# Altium project Inte_Car.PrjPCB
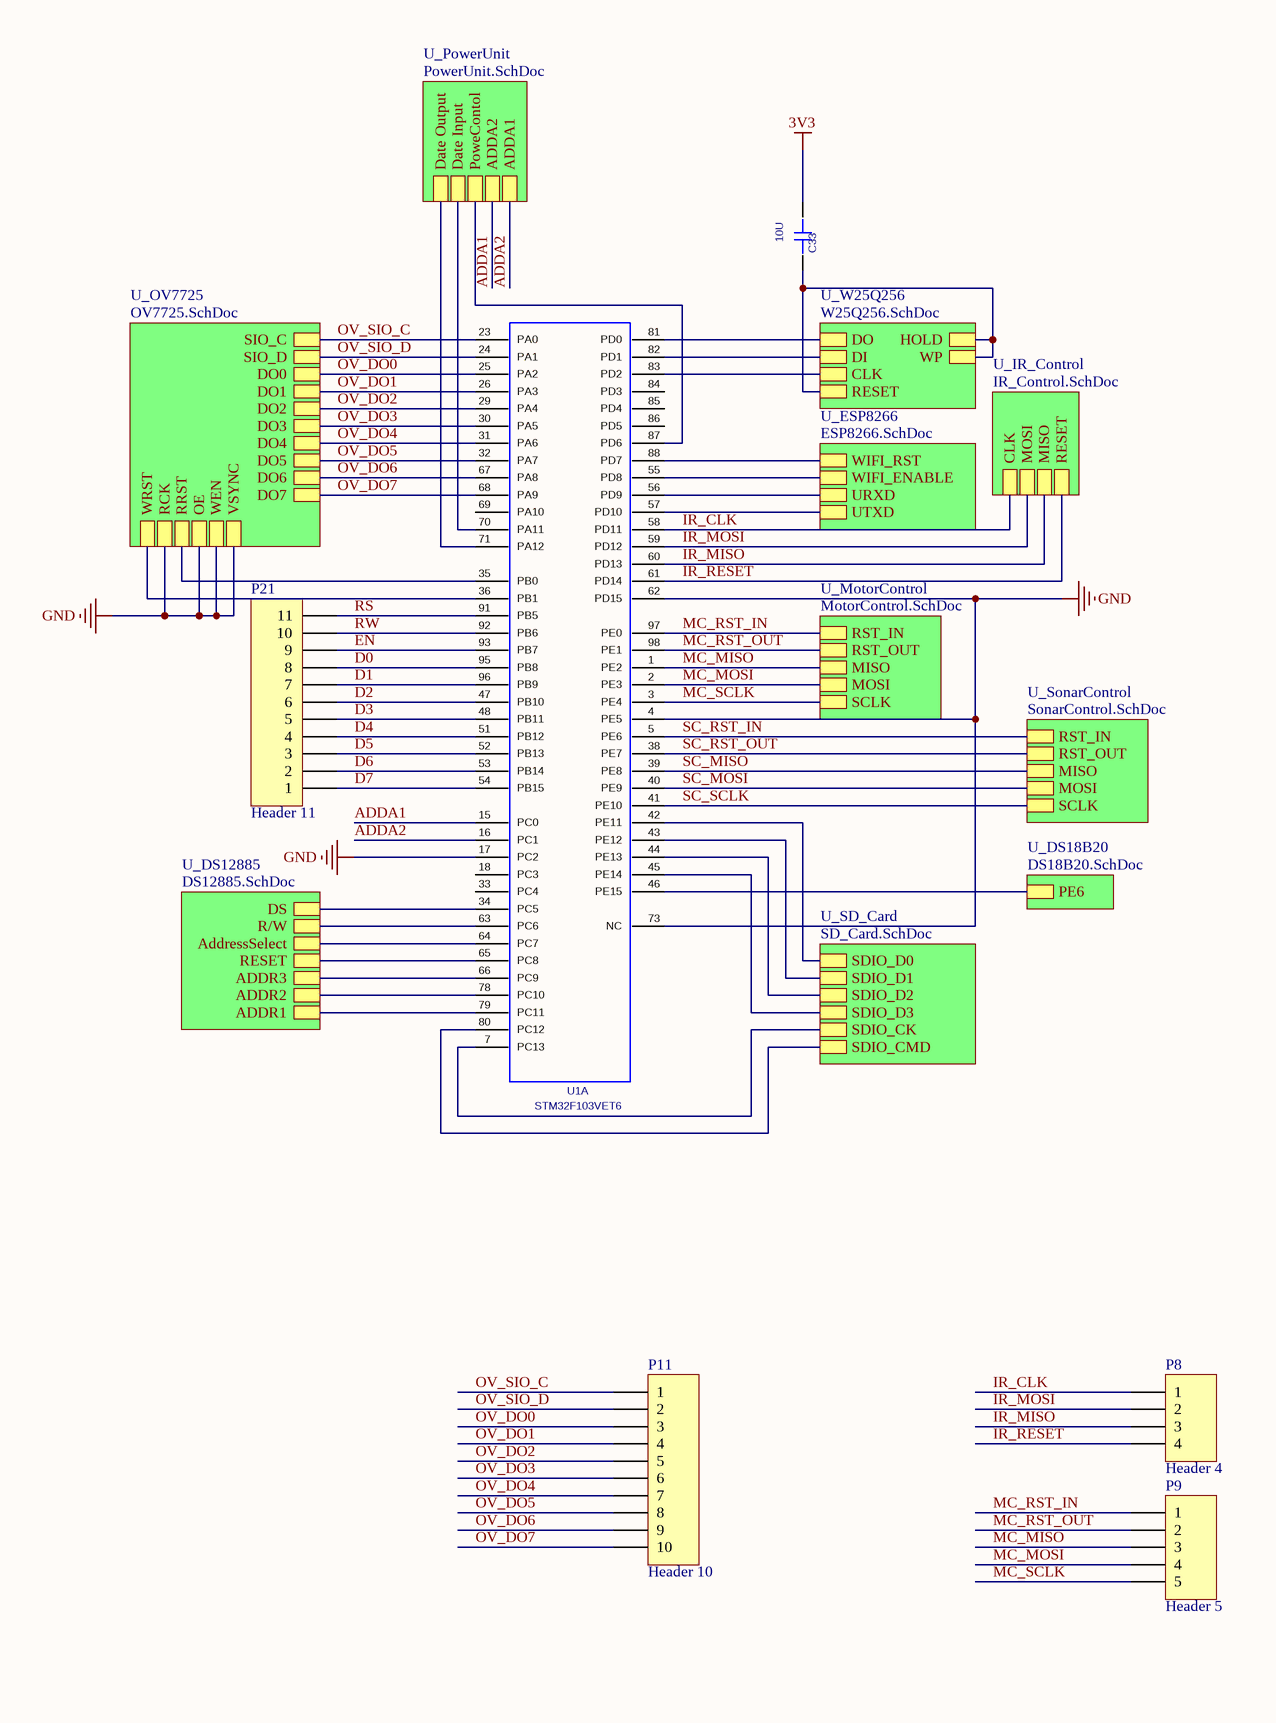
[diagram p0: MainBoard.SchDoc, left]
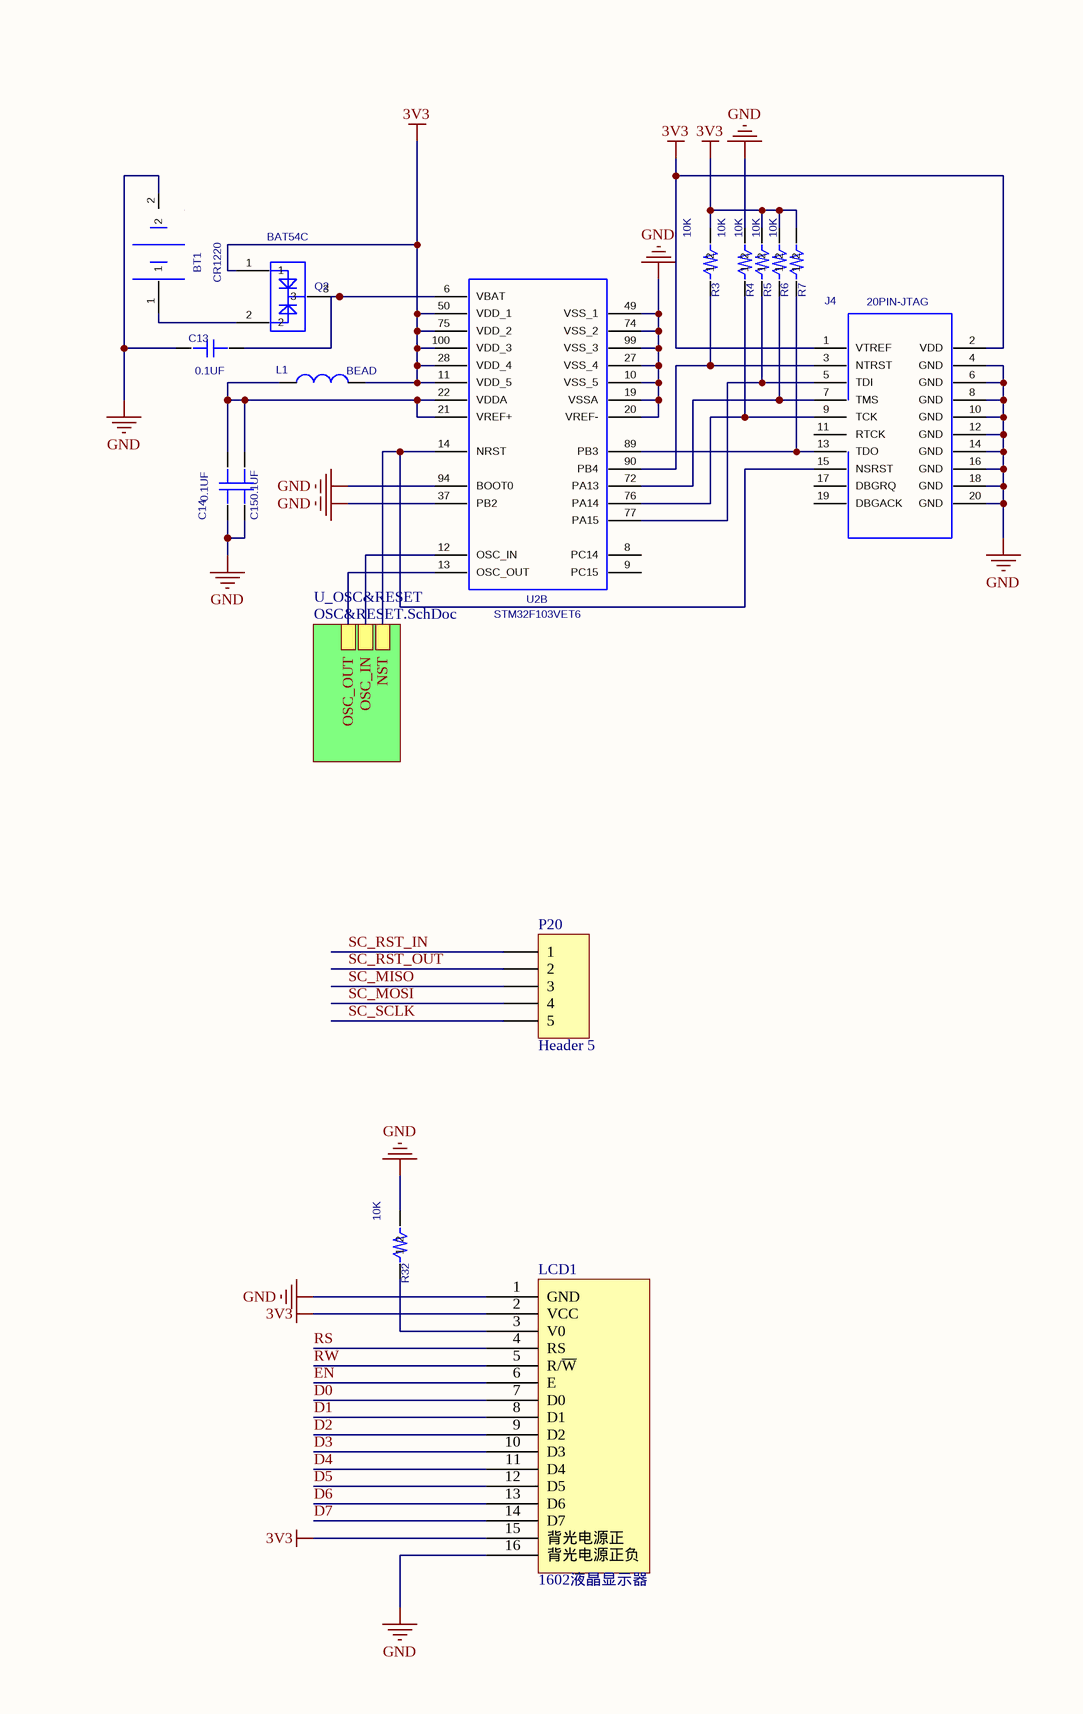
[diagram p1: MainBoard.SchDoc, right]
17 sheets, 196 parts. Net scope: hierarchical (ports join the sheet entries above them; power ports are global).
Board files: IR.PcbDoc, IR_Detector.PcbDoc, MotorControl.PcbDoc, SonarControl.PcbDoc, MainBoard.PcbDoc
Sheets:
  MainBoard.SchDoc
    U_OSC&RESET = OSC&RESET.SchDoc
    U_OV7725 = OV7725.SchDoc
      U_OV7725_CRYSTAL = OV7725_CRYSTAL.SchDoc
      U_AL422B = AL422B.SchDoc
      U_SN74LVC1G00 = SN74LVC1G00.SchDoc
    U_W25Q256 = W25Q256.SchDoc
    U_ESP8266 = ESP8266.SchDoc
      U_25Q80_SO = 25Q80_SO.SchDoc
    U_DS18B20 = DS18B20.SchDoc
    U_IR_Control = IR_Control.SchDoc
      U_IR = IR.SchDoc
      U_IR = IR.SchDoc
      U_IR = IR.SchDoc
      U_IR = IR.SchDoc
    U_MotorControl = MotorControl.SchDoc
    U_SonarControl = SonarControl.SchDoc
    U_SD_Card = SD_Card.SchDoc
    U_DS12885 = DS12885.SchDoc
    U_PowerUnit = PowerUnit.SchDoc

## Sheet MainBoard.SchDoc
size A3

### Parts
BT1  CR1220  [BATERY]
C13  value 0.1UF  [CAP_0603_FIRE]  (hidden comment: CAP_0.1UF_0603_FIRE)
C14  value 0.1UF  [CAP_0603_FIRE]  (hidden comment: CAP_0.1UF_0603_FIRE)
C15  value 0.1UF  [CAP_0603_FIRE]  (hidden comment: CAP_0.1UF_0603_FIRE)
C33  value 10U  [CAP_0603_FIRE]  (hidden comment: C_10UF_0603)
J4  20PIN-JTAG  [FC20H]
L1  value BEAD  [L0603]  (hidden comment: BEAD-220/100MHZ-0603)
LCD1  1602液晶显示器  [LCD1602A]
P8  Header 4  [HDR1X4]
P9  Header 5  [HDR1X5]
P11  Header 10  [HDR1X10]
P20  Header 5  [HDR1X5]
P21  Header 11  [HDR1X11]
Q2  BAT54C  [SOT-23]
R3  value 10K  [RES_0603_FIRE]  (hidden comment: RES_10K_0603_FIRE)
R4  value 10K  [RES_0603_FIRE]  (hidden comment: RES_10K_0603_FIRE)
R5  value 10K  [RES_0603_FIRE]  (hidden comment: RES_10K_0603_FIRE)
R6  value 10K  [RES_0603_FIRE]  (hidden comment: RES_10K_0603_FIRE)
R7  value 10K  [RES_0603_FIRE]  (hidden comment: RES_10K_0603_FIRE)
R32  value 10K  [RES_0603_FIRE]  (hidden comment: RES_10K_0603_FIRE)
U1  STM32F103VET6  [STM32F103VET6-LQFP]  (part A of 2)
U2  STM32F103VET6  [STM32F103VET6-LQFP]  (part B of 2)

### Sub-sheets
U_DS18B20 = DS18B20.SchDoc: PE6
U_DS12885 = DS12885.SchDoc: ADDR1, ADDR2, ADDR3, RESET, AddressSelect, R/W, DS
U_ESP8266 = ESP8266.SchDoc: WIFI_RST, WIFI_ENABLE, URXD, UTXD
U_IR_Control = IR_Control.SchDoc: CLK, MOSI, MISO, RESET
U_MotorControl = MotorControl.SchDoc: RST_IN, RST_OUT, MISO, MOSI, SCLK
U_OSC&RESET = OSC&RESET.SchDoc: NST, OSC_IN, OSC_OUT
U_OV7725 = OV7725.SchDoc: SIO_C, VSYNC, WRST, RCK, RRST, OE, WEN, SIO_D, DO7, DO0, DO1, DO2, DO3, DO4, DO5, DO6
U_PowerUnit = PowerUnit.SchDoc: Date Output, Date Input, PoweContol, ADDA2, ADDA1
U_SD_Card = SD_Card.SchDoc: SDIO_D0, SDIO_D1, SDIO_D2, SDIO_D3, SDIO_CK, SDIO_CMD
U_SonarControl = SonarControl.SchDoc: RST_IN, RST_OUT, MISO, MOSI, SCLK
U_W25Q256 = W25Q256.SchDoc: HOLD, RESET, DO, DI, WP, CLK

### Nets
3V3: C33.2 J4.1(VTREF) J4.2(VDD) L1.2 LCD1.2(VCC) LCD1.15(背光电源正) Q2.1 R3.2 R5.2 R6.2 R7.2 U2.11(VDD_5) U2.28(VDD_4) U2.50(VDD_1) U2.75(VDD_2) U2.100(VDD_3)
ADDA2: U1.16(PC1) ; sheet U_PowerUnit/ADDA1
GND: BT1.2 C13.2 C14.1 C15.1 J4.4(GND) J4.6(GND) J4.8(GND) J4.10(GND) J4.12(GND) J4.14(GND) J4.16(GND) J4.18(GND) J4.20(GND) LCD1.1(GND) LCD1.16(背光电源正负) R4.2 R32.2 U1.4(PE5) U1.17(PC2) U1.62(PD15) U1.73(NC) U2.10(VSS_5) U2.19(VSSA) U2.20(VREF-) U2.27(VSS_4) U2.37(PB2) U2.49(VSS_1) U2.74(VSS_2) U2.94(BOOT0) U2.99(VSS_3) ; sheet U_OV7725/VSYNC, sheet U_OV7725/RCK, sheet U_OV7725/OE, sheet U_OV7725/WEN
ADDA1: U1.15(PC0) ; sheet U_PowerUnit/ADDA2
D0: LCD1.7(D0) P21.8 U1.95(PB8)
D1: LCD1.8(D1) P21.7 U1.96(PB9)
D2: LCD1.9(D2) P21.6 U1.47(PB10)
D3: LCD1.10(D3) P21.5 U1.48(PB11)
D4: LCD1.11(D4) P21.4 U1.51(PB12)
D5: LCD1.12(D5) P21.3 U1.52(PB13)
D6: LCD1.13(D6) P21.2 U1.53(PB14)
D7: LCD1.14(D7) P21.1 U1.54(PB15)
EN: LCD1.6(E) P21.9 U1.93(PB7)
IR_CLK: P8.1 U1.58(PD11) ; sheet U_IR_Control/CLK
IR_MISO: P8.3 U1.60(PD13) ; sheet U_IR_Control/MISO
IR_MOSI: P8.2 U1.59(PD12) ; sheet U_IR_Control/MOSI
IR_RESET: P8.4 U1.61(PD14) ; sheet U_IR_Control/RESET
MC_MISO: P9.3 U1.1(PE2) ; sheet U_MotorControl/MISO
MC_MOSI: P9.4 U1.2(PE3) ; sheet U_MotorControl/MOSI
MC_RST_IN: P9.1 U1.97(PE0) ; sheet U_MotorControl/RST_IN
MC_RST_OUT: P9.2 U1.98(PE1) ; sheet U_MotorControl/RST_OUT
MC_SCLK: P9.5 U1.3(PE4) ; sheet U_MotorControl/SCLK
OV_DO0: P11.3 U1.25(PA2) ; sheet U_OV7725/DO0
OV_DO1: P11.4 U1.26(PA3) ; sheet U_OV7725/DO1
OV_DO2: P11.5 U1.29(PA4) ; sheet U_OV7725/DO2
OV_DO3: P11.6 U1.30(PA5) ; sheet U_OV7725/DO3
OV_DO4: P11.7 U1.31(PA6) ; sheet U_OV7725/DO4
OV_DO5: P11.8 U1.32(PA7) ; sheet U_OV7725/DO5
OV_DO6: P11.9 U1.67(PA8) ; sheet U_OV7725/DO6
OV_DO7: P11.10 U1.68(PA9) ; sheet U_OV7725/DO7
OV_SIO_C: P11.1 U1.23(PA0) ; sheet U_OV7725/SIO_C
OV_SIO_D: P11.2 U1.24(PA1) ; sheet U_OV7725/SIO_D
RS: LCD1.4(RS) P21.11 U1.91(PB5)
RW: LCD1.5(R/~{W}) P21.10 U1.92(PB6)
SC_MISO: P20.3 U1.39(PE8) ; sheet U_SonarControl/MISO  [project net MISO_2]
SC_MOSI: P20.4 U1.40(PE9) ; sheet U_SonarControl/MOSI  [project net MOSI_2]
SC_RST_IN: P20.1 U1.5(PE6) ; sheet U_SonarControl/RST_IN  [project net RST_IN_2]
SC_RST_OUT: P20.2 U1.38(PE7) ; sheet U_SonarControl/RST_OUT  [project net RST_OUT_2]
SC_SCLK: P20.5 U1.41(PE10) ; sheet U_SonarControl/SCLK
NetBT1_1: BT1.1 Q2.2
NetC1_2: U2.12(OSC_IN) ; sheet U_OSC&RESET/OSC_IN
NetC2_2: J4.15(NSRST) U2.14(NRST) ; sheet U_OSC&RESET/NST
NetC3_2: U2.13(OSC_OUT) ; sheet U_OSC&RESET/OSC_OUT
NetC13_1: C13.1 Q2.3 U2.6(VBAT)
NetC14_2: C14.2 C15.2 L1.1 U2.21(VREF+) U2.22(VDDA)
NetC30_2: U1.35(PB0) ; sheet U_OV7725/RRST
NetC31_2: U1.36(PB1) ; sheet U_OV7725/WRST
NetC33_1: C33.1 ; sheet U_W25Q256/HOLD, sheet U_W25Q256/RESET, sheet U_W25Q256/WP
NetC47_2: U1.65(PC8) ; sheet U_DS12885/RESET
NetD3_K: U1.57(PD10) ; sheet U_ESP8266/UTXD
NetJ3_2: U1.71(PA12) ; sheet U_PowerUnit/Date Output
NetJ3_3: U1.70(PA11) ; sheet U_PowerUnit/Date Input
NetJ4_3: J4.3(NTRST) R3.1 U2.90(PB4)
NetJ4_5: J4.5(TDI) R5.1 U2.77(PA15)
NetJ4_7: J4.7(TMS) R6.1 U2.72(PA13)
NetJ4_9: J4.9(TCK) R4.1 U2.76(PA14)
NetJ4_13: J4.13(TDO) R7.1 U2.89(PB3)
NetLCD1_3: LCD1.3(V0) R32.1
NetQ1_1: U1.87(PD6) ; sheet U_PowerUnit/PoweContol
NetR16_1: U1.46(PE15) ; sheet U_DS18B20/PE6
NetR21_1: U1.55(PD8) ; sheet U_ESP8266/WIFI_ENABLE
NetR26_1: U1.80(PC12) ; sheet U_SD_Card/SDIO_CMD
NetR27_1: U1.7(PC13) ; sheet U_SD_Card/SDIO_CK
NetR28_1: U1.45(PE14) ; sheet U_SD_Card/SDIO_D3
NetR29_1: U1.44(PE13) ; sheet U_SD_Card/SDIO_D2
NetR30_1: U1.43(PE12) ; sheet U_SD_Card/SDIO_D1
NetR31_1: U1.42(PE11) ; sheet U_SD_Card/SDIO_D0
NetU1_34: U1.34(PC5) ; sheet U_DS12885/DS
NetU1_56: U1.56(PD9) ; sheet U_ESP8266/URXD
NetU1_63: U1.63(PC6) ; sheet U_DS12885/R/W
NetU1_64: U1.64(PC7) ; sheet U_DS12885/AddressSelect
NetU1_66: U1.66(PC9) ; sheet U_DS12885/ADDR3
NetU1_78: U1.78(PC10) ; sheet U_DS12885/ADDR2
NetU1_79: U1.79(PC11) ; sheet U_DS12885/ADDR1
NetU1_81: U1.81(PD0) ; sheet U_W25Q256/DO
NetU1_82: U1.82(PD1) ; sheet U_W25Q256/DI
NetU1_83: U1.83(PD2) ; sheet U_W25Q256/CLK
NetU1_88: U1.88(PD7) ; sheet U_ESP8266/WIFI_RST

Not connected (* = marked no-connect by the designer): J4 11(RTCK) 17(DBGRQ) 19(DBGACK); U1 18(PC3) 33(PC4) 69(PA10) 84(PD3) 85(PD4) 86(PD5); U2 8(PC14) 9(PC15)

### Library data of the parts
C13-C15 = CAP_0.1UF_0603_FIRE: SURFACE MOUNT CAPACITOR 0.031 X 0.061 INCHES; PCB DECAL: CAP_0603_FIRE
J4 = 20PIN-JTAG: 20pin JTAG; Manufacturer #1: 20pin JTAG; Manufacturer #1 PN: 20pin JTAG; Value: 20pin JTAG; PCB DECAL: FC20H
L1 = BEAD-220/100MHZ-0603: 0603,BEAD; Manufacturer #1 PN: BEAD; PCB DECAL: L0603
P8 = Header 4: Header, 4-Pin; LatestRevisionDate: 17-Jul-2002; LatestRevisionNote: Re-released for DXP Platform.; Publisher: Altium Limited
P9 P20 = Header 5: Header, 5-Pin; LatestRevisionDate: 17-Jul-2002; LatestRevisionNote: Re-released for DXP Platform.; Publisher: Altium Limited
P11 = Header 10: Header, 10-Pin; LatestRevisionDate: 17-Jul-2002; LatestRevisionNote: Re-released for DXP Platform.; Publisher: Altium Limited
P21 = Header 11: Header, 11-Pin; LatestRevisionDate: 17-Jul-2002; LatestRevisionNote: Re-released for DXP Platform.; Publisher: Altium Limited
R3-R7 R32 = RES_10K_0603_FIRE: SURFACE MOUNT RESISTOR 0.031 X 0.061 INCHES, 1/10W; Assembly: SMD; PCB DECAL: RES_0603_FIRE
U1 U2 = STM32F103VET6: Geometry.Height: 62.99mil; Protel.FootprintDescription: TSQFP, 100-Leads, Body 16.2x16.2mm (max), Pitch 0.50mm, IP; Value: STM32F103VET6; PCB DECAL: STM32F103VET6-LQFP
BT1 = CR1220: PCB DECAL: BATERY
C33 = C_10UF_0603: PCB DECAL: CAP_0603_FIRE
Q2 = BAT54C: Value: BAT54C; PCB DECAL: SOT-23

## Sheet OSC&RESET.SchDoc
size A4
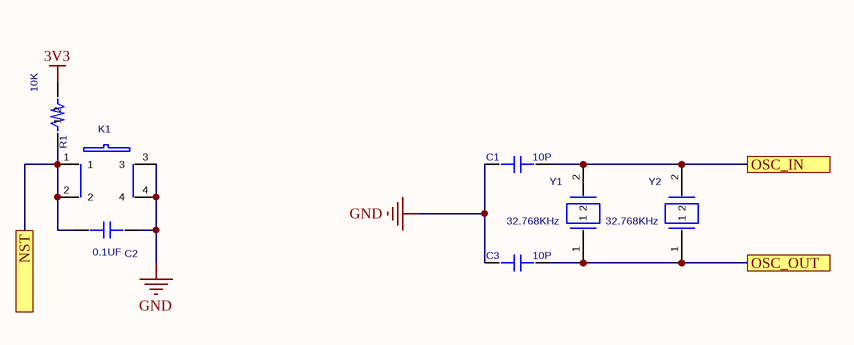
[diagram p2: OSC&RESET.SchDoc]

### Parts
C1  value 10P  [RES_0603_FIRE]  (hidden comment: CAP_10P_0603_FIRE)
C2  value 0.1UF  [CAP_0603_FIRE]  (hidden comment: CAP_0.1UF_0603_FIRE)
C3  value 10P  [RES_0603_FIRE]  (hidden comment: CAP_10P_0603_FIRE)
K1  KEY  [SW6.2/6.2-SMD]  (value not drawn)
R1  value 10K  [RES_0603_FIRE]  (hidden comment: RES_10K_0603_FIRE)
Y1  value 32.768KHz  [3215]  (hidden comment: XTAL_32.768KHZ_3215)
Y2  value 32.768KHz  [3215]  (hidden comment: XTAL_32.768KHZ_3215)

### Ports
NST, OSC_IN, OSC_OUT

### Nets
3V3: R1.2
GND: C1.1 C2.1 C3.1 K1.3 K1.4
NetC1_2: C1.2 Y1.2 Y2.2 ; port OSC_IN
NetC2_2: C2.2 K1.1 K1.2 R1.1 ; port NST
NetC3_2: C3.2 Y1.1 Y2.1 ; port OSC_OUT

### Library data of the parts
C1 C3 = CAP_10P_0603_FIRE: 0603; Manufacture 1: SUPERCAP; Tolerance: +-5%; PCB DECAL: RES_0603_FIRE
C2 = CAP_0.1UF_0603_FIRE: as C13 on sheet MainBoard; PCB DECAL: CAP_0603_FIRE
R1 = RES_10K_0603_FIRE: as R3 on sheet MainBoard; PCB DECAL: RES_0603_FIRE
Y1 Y2 = XTAL_32.768KHZ_3215: CRYSTAL; PCB DECAL: 3215
K1 = KEY: Manufacturer #1 PN: KEY; PCB DECAL: SW6.2/6.2-SMD

## Sheet OV7725.SchDoc
size A4
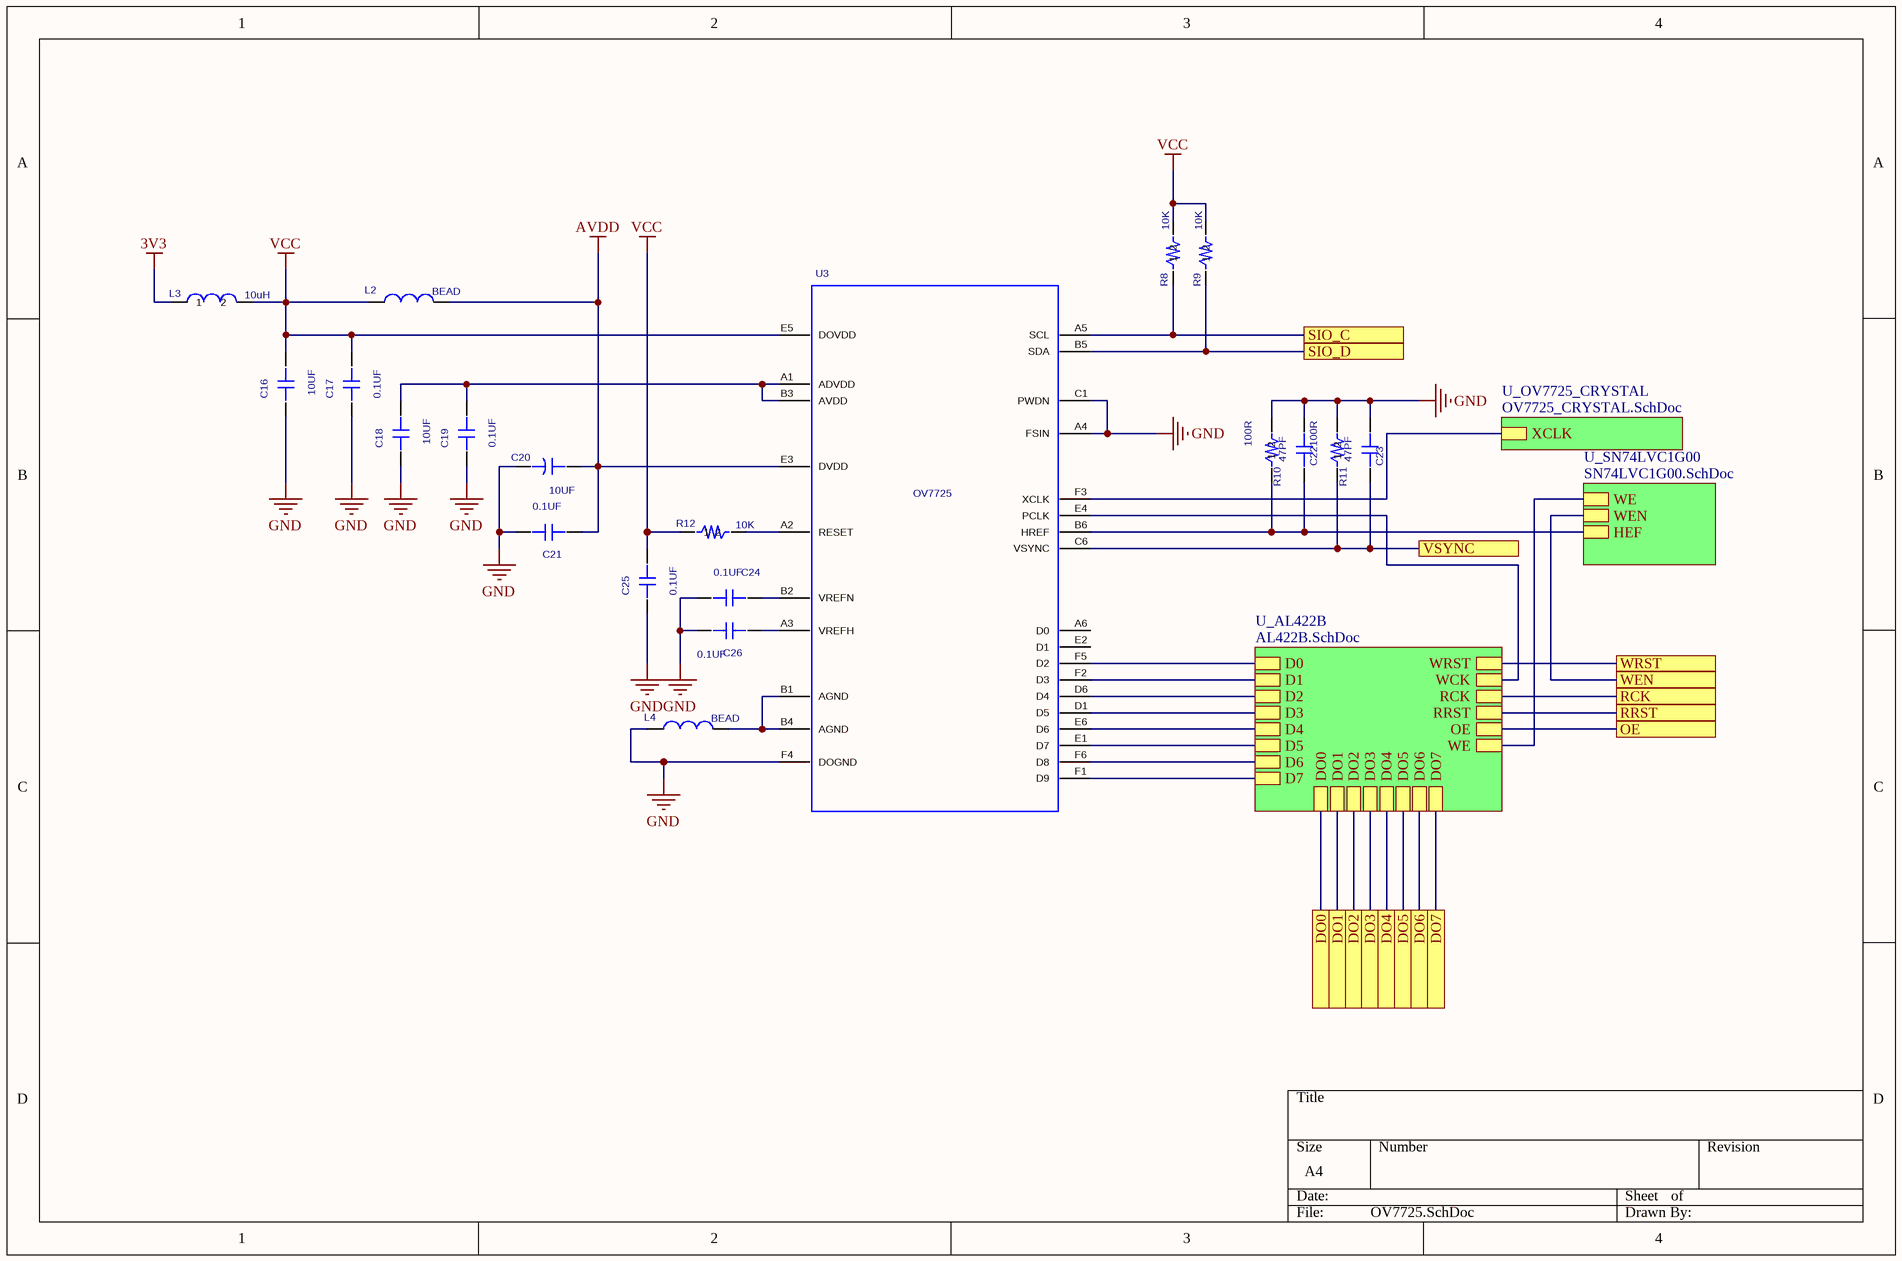
[diagram p3: OV7725.SchDoc]

### Parts
C16  value 10UF  [CAP_0603_FIRE]  (hidden comment: CAP_10UF_0603_FIRE)
C17  value 0.1UF  [SC0402]  (hidden comment: CAP_0.1UF_0402_FIRE)
C18  value 10UF  [CAP_0603_FIRE]  (hidden comment: CAP_10UF_0603_FIRE)
C19  value 0.1UF  [SC0402]  (hidden comment: CAP_0.1UF_0402_FIRE)
C20  value 10UF  [C1206]  (hidden comment: CAP+_10UF_C1206_FIRE)
C21  value 0.1UF  [SC0402]  (hidden comment: CAP_0.1UF_0402_FIRE)
C22  value 47PF  [SC0402]  (hidden comment: CAP_47PF_0402_FIRE)
C23  value 47PF  [SC0402]  (hidden comment: CAP_47PF_0402_FIRE)
C24  value 0.1UF  [SC0402]  (hidden comment: CAP_0.1UF_0402_FIRE)
C25  value 0.1UF  [SC0402]  (hidden comment: CAP_0.1UF_0402_FIRE)
C26  value 0.1UF  [SC0402]  (hidden comment: CAP_0.1UF_0402_FIRE)
L2  value BEAD  [L0603]  (hidden comment: BEAD-220/100MHZ-0603)
L3  value 10uH  [L0805]  (hidden comment: IND_10UH_0805_FIRE)
L4  value BEAD  [L0603]  (hidden comment: BEAD-220/100MHZ-0603)
R8  value 10K  [SR0402]  (hidden comment: RES_10K_0402_FIRE)
R9  value 10K  [SR0402]  (hidden comment: RES_10K_0402_FIRE)
R10  value 100R  [SR0402]  (hidden comment: RES_100R_0402_FIRE)
R11  value 100R  [SR0402]  (hidden comment: RES_100R_0402_FIRE)
R12  value 10K  [SR0402]  (hidden comment: RES_10K_0402_FIRE)
U3  value OV7725  [OV7725_CSP2_FIRE]  (hidden comment: OV7725_FIRE)

### Sub-sheets
U_AL422B = AL422B.SchDoc: D0, D1, D2, D3, D4, D5, D6, D7, WE, WRST, WCK, RCK, RRST, OE, DO0, DO7, DO1, DO2, DO3, DO4, DO5, DO6
U_OV7725_CRYSTAL = OV7725_CRYSTAL.SchDoc: XCLK
U_SN74LVC1G00 = SN74LVC1G00.SchDoc: WE, HEF, WEN

### Ports
DO0, DO1, DO2, DO3, DO4, DO5, DO6, DO7, OE, RCK, RRST, SIO_C, SIO_D, VSYNC, WEN, WRST

### Nets
3V3: L3.1
AVDD: C20.1(+) C21.1 L2.2 U3.E3(DVDD)
GND: C16.1 C17.1 C18.1 C19.1 C20.2(-) C21.2 C22.2 C23.1 C23.2 C24.2 C25.1 C26.2 L4.1 R10.2 R11.1 R11.2 U3.A4(FSIN) U3.C1(PWDN) U3.C6(VSYNC) U3.F4(DOGND) ; port VSYNC, port RCK, port OE, port WEN, sheet U_AL422B/RCK, sheet U_AL422B/OE, sheet U_SN74LVC1G00/WEN
VCC: C16.2 C17.2 C25.2 L2.1 L3.2 R8.2 R9.2 R12.1 U3.E5(DOVDD)
OV_DO0: port DO0, sheet U_AL422B/DO0
OV_DO1: port DO1, sheet U_AL422B/DO1
OV_DO2: port DO2, sheet U_AL422B/DO2
OV_DO3: port DO3, sheet U_AL422B/DO3
OV_DO4: port DO4, sheet U_AL422B/DO4
OV_DO5: port DO5, sheet U_AL422B/DO5
OV_DO6: port DO6, sheet U_AL422B/DO6
OV_DO7: port DO7, sheet U_AL422B/DO7
OV_SIO_C: R8.1 U3.A5(SCL) ; port SIO_C
OV_SIO_D: R9.1 U3.B5(SDA) ; port SIO_D
NetC18_2: C18.2 C19.2 U3.A1(ADVDD) U3.B3(AVDD)
NetC22_1: C22.1 R10.1 U3.B6(HREF) ; sheet U_SN74LVC1G00/HEF
NetC24_1: C24.1 U3.B2(VREFN)
NetC26_1: C26.1 U3.A3(VREFH)
NetC30_2: port RRST, sheet U_AL422B/RRST
NetC31_2: port WRST, sheet U_AL422B/WRST
NetL4_2: L4.2 U3.B1(AGND) U3.B4(AGND)
NetR12_2: R12.2 U3.A2(RESET)
NetU3_D1: U3.D1(D5) ; sheet U_AL422B/D3
NetU3_D6: U3.D6(D4) ; sheet U_AL422B/D2
NetU3_E1: U3.E1(D7) ; sheet U_AL422B/D5
NetU3_E4: U3.E4(PCLK) ; sheet U_AL422B/WCK
NetU3_E6: U3.E6(D6) ; sheet U_AL422B/D4
NetU3_F1: U3.F1(D9) ; sheet U_AL422B/D7
NetU3_F2: U3.F2(D3) ; sheet U_AL422B/D1
NetU3_F3: U3.F3(XCLK) ; sheet U_OV7725_CRYSTAL/XCLK
NetU3_F5: U3.F5(D2) ; sheet U_AL422B/D0
NetU3_F6: U3.F6(D8) ; sheet U_AL422B/D6
NetU4_4: sheet U_AL422B/WE, sheet U_SN74LVC1G00/WE

Not connected (* = marked no-connect by the designer): U3 A6(D0) E2(D1)

### Library data of the parts
C16 C18 = CAP_10UF_0603_FIRE: SURFACE MOUNT CAPACITOR 0.031 X 0.061 INCHES; PCB DECAL: CAP_0603_FIRE
C17 C19 C21 C24-C26 = CAP_0.1UF_0402_FIRE: 0402; Manufacture 1 P/N: 0.1uF(0402); PCB DECAL: SC0402
C22 C23 = CAP_47PF_0402_FIRE: Manufacture 1 P/N: 47PF(0402); PCB DECAL: SC0402
L2 L4 = BEAD-220/100MHZ-0603: 0603,BEAD; Manufacturer #1 PN: BEAD; PCB DECAL: L0603
L3 = IND_10UH_0805_FIRE: 0805; Manufacture 1 P/N: 10uH; PCB DECAL: L0805
R8 R9 R12 = RES_10K_0402_FIRE: 0402; Manufacture 1: SUPEROHM; Assembly: SMD; Tolerance: +-5%; PCB DECAL: SR0402
R10 R11 = RES_100R_0402_FIRE: 100R(0402); Assembly: SMD; PCB DECAL: SR0402
U3 = OV7725_FIRE: OV7725,30w; Manufacture 1: OV; Assembly: SMD; Manufacture 1 P/N: OV7725; PCB DECAL: OV7725_CSP2_FIRE
C20 = CAP+_10UF_C1206_FIRE: Manufacture 1 P/N: 10uF; PCB DECAL: C1206

## Sheet OV7725_CRYSTAL.SchDoc
size A4
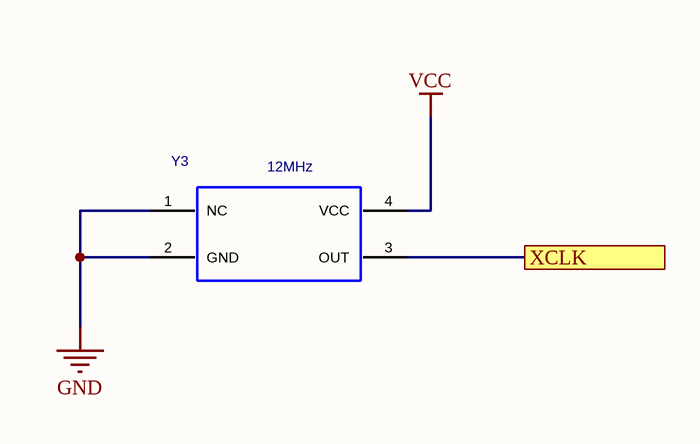
[diagram p4: OV7725_CRYSTAL.SchDoc]

### Parts
Y3  value 12MHz  [CRYSTAL_SMD3.2X2.5_FIRE]  (hidden comment: CRYSTAL_12MHZ_FIRE)

### Ports
XCLK

### Nets
GND: Y3.1(NC) Y3.2(GND)
VCC: Y3.4(VCC)
NetU3_F3: Y3.3(OUT) ; port XCLK

### Library data of the parts
Y3 = CRYSTAL_12MHZ_FIRE: 12MHz; Manufacture 1 P/N: 12MHz; PCB DECAL: CRYSTAL_SMD3.2X2.5_FIRE

## Sheet AL422B.SchDoc
size A4
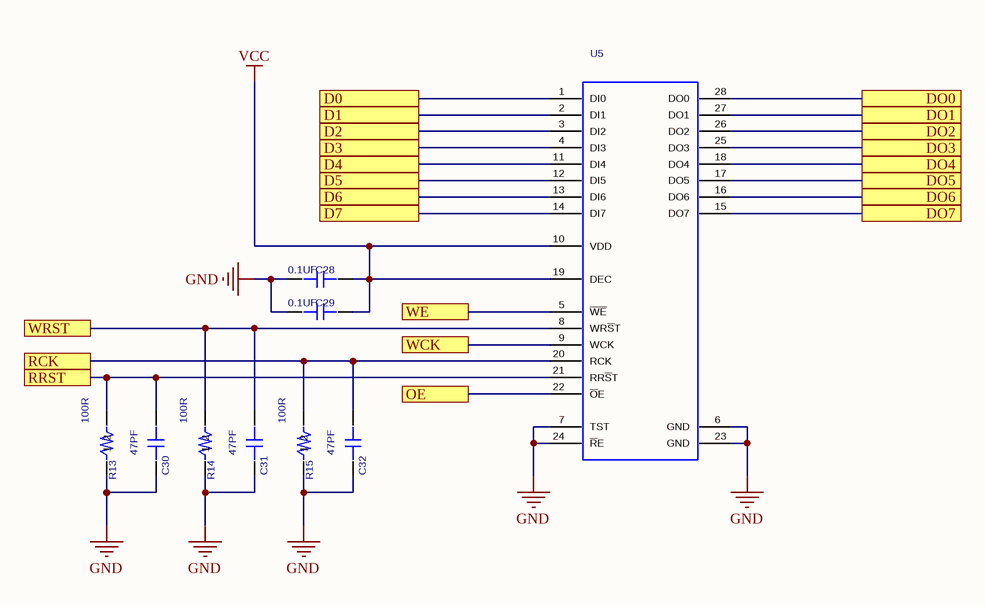
[diagram p5: AL422B.SchDoc]

### Parts
C28  value 0.1UF  [SC0402]  (hidden comment: CAP_0.1UF_0402_FIRE)
C29  value 0.1UF  [SC0402]  (hidden comment: CAP_0.1UF_0402_FIRE)
C30  value 47PF  [SC0402]  (hidden comment: CAP_47PF_0402_FIRE)
C31  value 47PF  [SC0402]  (hidden comment: CAP_47PF_0402_FIRE)
C32  value 47PF  [SC0402]  (hidden comment: CAP_47PF_0402_FIRE)
R13  value 100R  [SR0402]  (hidden comment: RES_100R_0402_FIRE)
R14  value 100R  [SR0402]  (hidden comment: RES_100R_0402_FIRE)
R15  value 100R  [SR0402]  (hidden comment: RES_100R_0402_FIRE)
U5  AL422B_FIRE  [AL422B(28PINS)]  (value not drawn)

### Ports
D0, D1, D2, D3, D4, D5, D6, D7, DO0, DO1, DO2, DO3, DO4, DO5, DO6, DO7, OE, RCK, RRST, WCK, WE, WRST

### Nets
GND: C28.2 C29.2 C30.1 C31.1 C32.1 C32.2 R13.1 R14.1 R15.1 R15.2 U5.6(GND) U5.7(TST) U5.20(RCK) U5.22(~{O}E) U5.23(GND) U5.24(~{R}E) ; port RCK, port OE
VCC: C28.1 C29.1 U5.10(VDD) U5.19(DEC)
OV_DO0: U5.28(DO0) ; port DO0
OV_DO1: U5.27(DO1) ; port DO1
OV_DO2: U5.26(DO2) ; port DO2
OV_DO3: U5.25(DO3) ; port DO3
OV_DO4: U5.18(DO4) ; port DO4
OV_DO5: U5.17(DO5) ; port DO5
OV_DO6: U5.16(DO6) ; port DO6
OV_DO7: U5.15(DO7) ; port DO7
NetC30_2: C30.2 R13.2 U5.21(RR~{S}T) ; port RRST
NetC31_2: C31.2 R14.2 U5.8(WR~{S}T) ; port WRST
NetU3_D1: U5.4(DI3) ; port D3
NetU3_D6: U5.3(DI2) ; port D2
NetU3_E1: U5.12(DI5) ; port D5
NetU3_E4: U5.9(WCK) ; port WCK
NetU3_E6: U5.11(DI4) ; port D4
NetU3_F1: U5.14(DI7) ; port D7
NetU3_F2: U5.2(DI1) ; port D1
NetU3_F5: U5.1(DI0) ; port D0
NetU3_F6: U5.13(DI6) ; port D6
NetU4_4: U5.5(~{WE}) ; port WE

### Library data of the parts
C28 C29 = CAP_0.1UF_0402_FIRE: 0402; Manufacture 1 P/N: 0.1uF(0402); PCB DECAL: SC0402
C30-C32 = CAP_47PF_0402_FIRE: Manufacture 1 P/N: 47PF(0402); PCB DECAL: SC0402
R13-R15 = RES_100R_0402_FIRE: 100R(0402); Assembly: SMD; PCB DECAL: SR0402
U5 = AL422B_FIRE: AL422B; Manufacture 1 P/N: AL422B; Value: AL422B; PCB DECAL: AL422B(28PINS)

## Sheet SN74LVC1G00.SchDoc
size A4
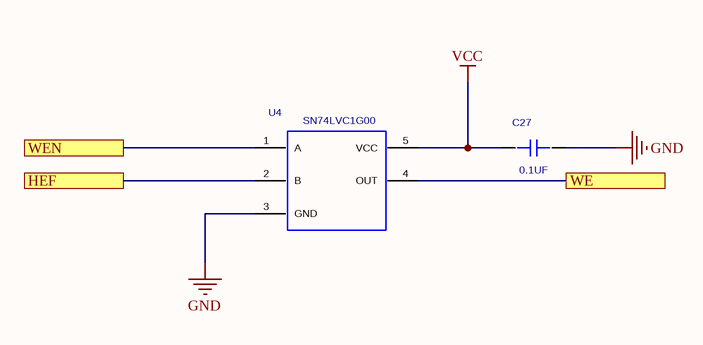
[diagram p6: SN74LVC1G00.SchDoc]

### Parts
C27  value 0.1UF  [SC0402]  (hidden comment: CAP_0.1UF_0402_FIRE)
U4  value SN74LVC1G00  [SOT353_FIRE]  (hidden comment: SN74LVC1G00_FIRE)

### Ports
HEF, WE, WEN

### Nets
GND: C27.1 U4.1(A) U4.3(GND) ; port WEN
VCC: C27.2 U4.5(VCC)
NetC22_1: U4.2(B) ; port HEF
NetU4_4: U4.4(OUT) ; port WE

### Library data of the parts
C27 = CAP_0.1UF_0402_FIRE: 0402; Manufacture 1 P/N: 0.1uF(0402); PCB DECAL: SC0402
U4 = SN74LVC1G00_FIRE: SN74LVC1G00; Manufacture 1 P/N: SN74LVC1G00; PCB DECAL: SOT353_FIRE

## Sheet W25Q256.SchDoc
size A4
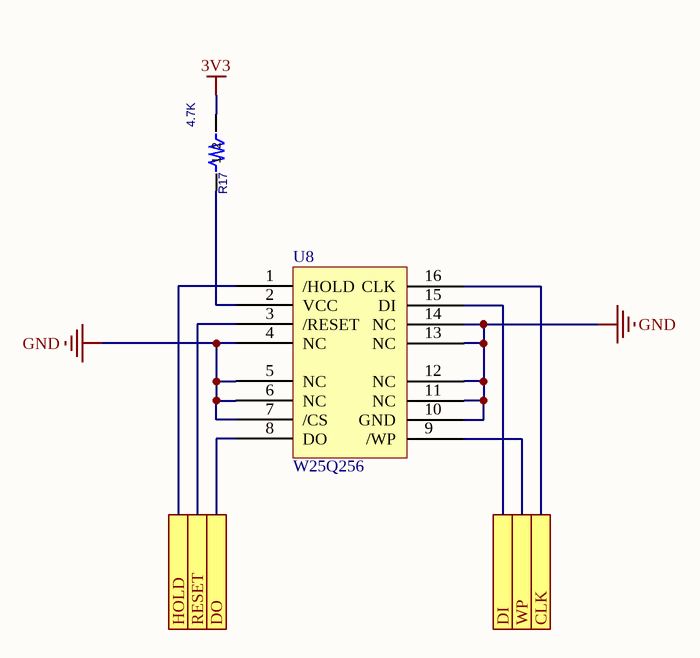
[diagram p7: W25Q256.SchDoc]

### Parts
R17  value 4.7K  [RES_0603_FIRE]  (hidden comment: RES_4K7_0603_FIRE)
U8  W25Q256  [W25Q256]

### Ports
CLK, DI, DO, HOLD, RESET, WP

### Nets
3V3: R17.2
GND: U8.4(NC) U8.5(NC) U8.6(NC) U8.7(/CS) U8.10(GND) U8.11(NC) U8.12(NC) U8.13(NC) U8.14(NC)
NetC33_1: U8.1(/HOLD) U8.3(/RESET) U8.9(/WP) ; port HOLD, port RESET, port WP
NetR17_1: R17.1 U8.2(VCC)
NetU1_81: U8.8(DO) ; port DO
NetU1_82: U8.15(DI) ; port DI
NetU1_83: U8.16(CLK) ; port CLK

### Library data of the parts
R17 = RES_4K7_0603_FIRE: 0402; Manufacture 1: SUPEROHM; Tolerance: +-5%; PCB DECAL: RES_0603_FIRE

## Sheet ESP8266.SchDoc
size A4
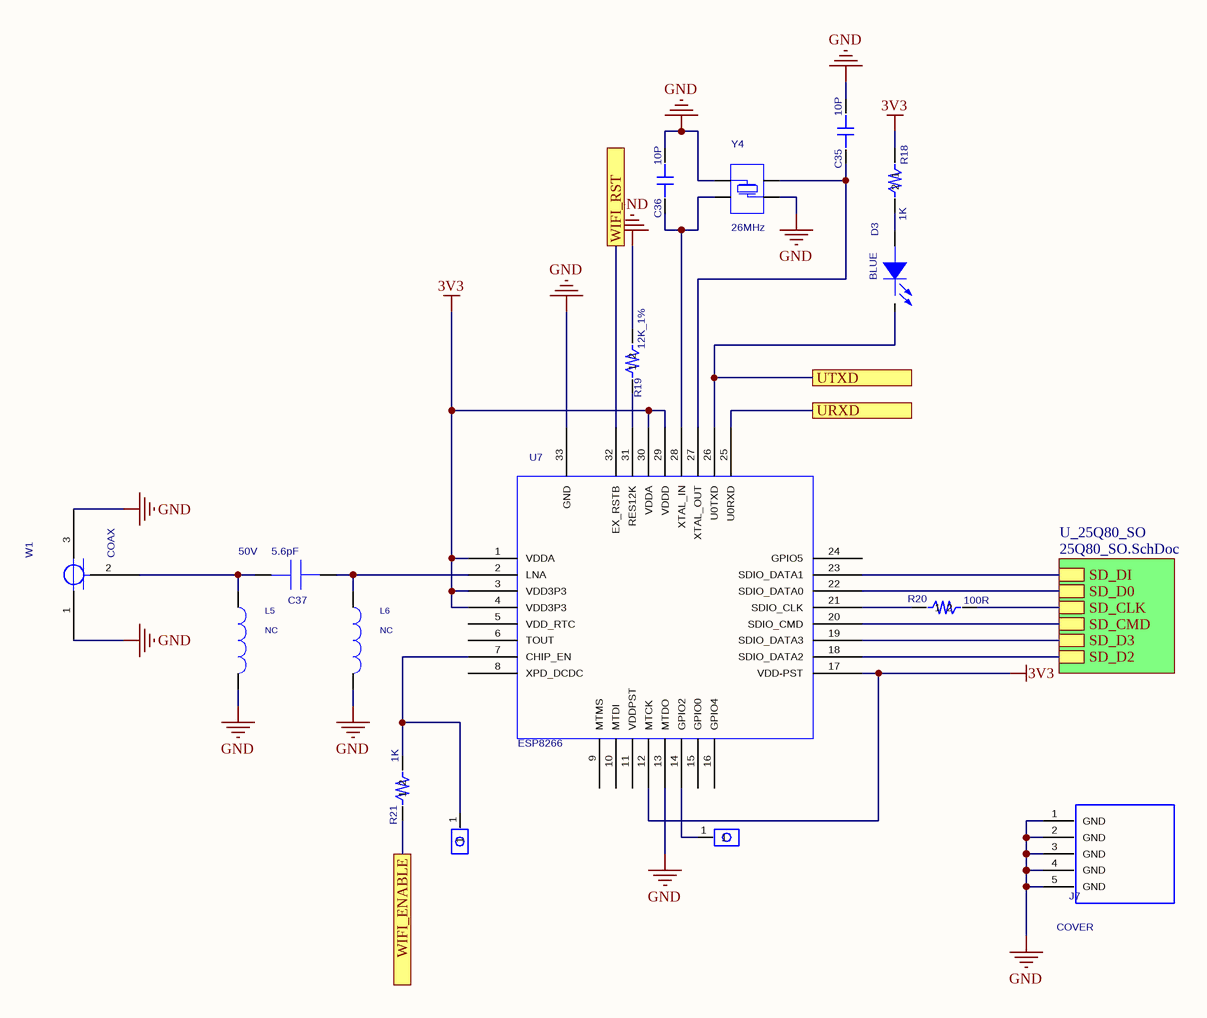
[diagram p8: ESP8266.SchDoc]

### Parts
C35  value 10P  [RES_0603_FIRE]  (hidden comment: CAP_10P_0603_FIRE)
C36  value 10P  [RES_0603_FIRE]  (hidden comment: CAP_10P_0603_FIRE)
C37  value 5.6pF  Voltage: 50V  [0603]  (hidden comment: CAP_NP)
D3  value BLUE  [LED_BLUE_0603_FIRE]  (hidden comment: LED_BLUE_0603_FIRE)
J5  1_DIP  [1_DIP]  (value not drawn)
J6  1_DIP  [1_DIP]  (value not drawn)
J7  COVER  [COVER1]
L5  value NC  [0603]  (hidden comment: IND)
L6  value NC  [0603]  (hidden comment: IND)
R18  value 1K  [RES_0603_FIRE]  (hidden comment: RES_1K_0603_FIRE)
R19  value 12K_1%  [RES_0603_FIRE]  (hidden comment: RES_12K_1%_0603_FIRE)
R20  value 100R  [RES_0603_FIRE]  (hidden comment: RES_100R_0603_FIRE)
R21  value 1K  [RES_0603_FIRE]  (hidden comment: RES_1K_0603_FIRE)
U7  ESP8266  [QFN32_1]
W1  COAX  [UFL-3]
Y4  value 26MHz  [NX3225SA]  (hidden comment: CRYSTAL5032)

### Sub-sheets
U_25Q80_SO = 25Q80_SO.SchDoc: SD_CMD, SD_D0, SD_D3, SD_D2, SD_CLK, SD_DI

### Ports
URXD, UTXD, WIFI_ENABLE, WIFI_RST

### Nets
3V3: R18.1 U7.1(VDDA) U7.3(VDD3P3) U7.4(VDD3P3) U7.12(MTCK) U7.17(VDD-PST) U7.29(VDDD) U7.30(VDDA)
GND: C35.2 C36.2 J7.1(GND) J7.2(GND) J7.3(GND) J7.4(GND) J7.5(GND) L5.2 L6.2 R19.2 U7.13(MTDO) U7.33(GND) W1.1(CENTER_1) W1.3(CENTER_2) Y4.1 Y4.3
Net*_1: U7.20(SDIO_CMD) ; sheet U_25Q80_SO/SD_CMD
Net*_2: U7.22(SDIO_DATA0) ; sheet U_25Q80_SO/SD_D0
Net*_3: U7.19(SDIO_DATA3) ; sheet U_25Q80_SO/SD_D3
Net*_5: U7.23(SDIO_DATA1) ; sheet U_25Q80_SO/SD_DI
Net*_6: R20.2 ; sheet U_25Q80_SO/SD_CLK
Net*_7: U7.18(SDIO_DATA2) ; sheet U_25Q80_SO/SD_D2
NetC35_1: C35.1 U7.27(XTAL_OUT) Y4.4
NetC36_1: C36.1 U7.28(XTAL_IN) Y4.2
NetC37_1: C37.1 L6.1 U7.2(LNA)
NetC37_2: C37.2 L5.1 W1.2(SHIELD)
NetD3_A: D3.A(ANODE) R18.2
NetD3_K: D3.K(CATHODE) U7.26(U0TXD) ; port UTXD
NetJ5_1: J5.1 U7.14(GPIO2)
NetJ6_1: J6.1 R21.2 U7.7(CHIP_EN)
NetR19_1: R19.1 U7.31(RES12K)
NetR20_1: R20.1 U7.21(SDIO_CLK)
NetR21_1: R21.1 ; port WIFI_ENABLE
NetU1_56: U7.25(U0RXD) ; port URXD
NetU1_88: U7.32(EX_RSTB) ; port WIFI_RST

Not connected (* = marked no-connect by the designer): U7 5(VDD_RTC) 6(TOUT) 8(XPD_DCDC) 9(MTMS) 10(MTDI) 11(VDDPST) 15(GPIO0) 16(GPIO4) 24(GPIO5)

### Library data of the parts
C35 C36 = CAP_10P_0603_FIRE: as C1 on sheet OSC&RESET; PCB DECAL: RES_0603_FIRE
C37 = CAP_NP: 0603, X7R, 50V, 10%(K); Partname: 贴片电容  0603; Mfr: Fenghua; Mfr_Part_Number: 0603B104K500NT; Part_Number: CA100039-01; Spec: 100nF/50V 10%(K) X7R,0603B104K500NT(风华); Remarks: Checked; Gtech_Number: 50306031003K50V01; Source_Path: D:\CADENCELIB\CAPTURELIB\LC_PASSIVE.OLB; PCB DECAL: 0603; Datasheet: D:\CadenceLib\Partbase\Datasheet\Capacitor\Fenghua\LC503_Fenghua-X7R.pdf; Tolerance: ±10%; Availability: 30
D3 = LED_BLUE_0603_FIRE: blue,0603; PCB DECAL: LED_BLUE_0603_FIRE
L5 L6 = IND: 1uH, 1.1R@245MHz, 245mA; Partname: 贴片电感; Mfr: TDK; Mfr_Part_Number: NLV25T-1R0J-PF; Part_Number: IN100085-01; Spec: 1uH,NLV25T-1R0J-PF(TDK); Tolerance: 5%; Resistance: 1.1R; Source_Path: D:\CADENCELIB\CAPTURELIB\LC_PASSIVE.OLB; PCB DECAL: 0603; Current: 245mA; Availability: 0
R18 R21 = RES_1K_0603_FIRE: 0402; Manufacture 1: SUPEROHM; Tolerance: +-5%; Assembly: SMD; PCB DECAL: RES_0603_FIRE
R19 = RES_12K_1%_0603_FIRE: 0402; Manufacture 1: SUPEROHM; Tolerance: +-1%; Assembly: SMD; PCB DECAL: RES_0603_FIRE
R20 = RES_100R_0603_FIRE: 0402; Manufacture 1: SUPEROHM; Tolerance: +-5%; Assembly: SMD; PCB DECAL: RES_0603_FIRE
U7 = ESP8266: Source_Path: C:\CADENCE\SPB_16.6\TOOLS\CAPTURE\LIBRARY\CAPSYM.OLB; PCB DECAL: QFN32_1; Value: ESP8266
W1 = COAX: Source_Path: C:\CADENCE\SPB_16.6\TOOLS\CAPTURE\LIBRARY\CONNECTOR.OLB; PCB DECAL: UFL-3; Value: COAX
Y4 = CRYSTAL5032: 27.12MHz,SMD5032,-30 to 85℃; Part_Number: OS200008-01; Mfr_Part_Number: E5SB27_1200F20G13; Mfr: Hosonic; Partname: 贴片晶振; Spec: 27.12MHz,E5SB27_1200F20G13(Hosonic); Source_Path: D:\CADENCELIB\CAPTURELIB\LC_DISCRETE.OLB; PCB DECAL: NX3225SA; Availability: 0
J5 J6 = 1_DIP: PCB DECAL: 1_DIP
J7 = COVER: PCB DECAL: COVER1

## Sheet 25Q80_SO.SchDoc
size A4
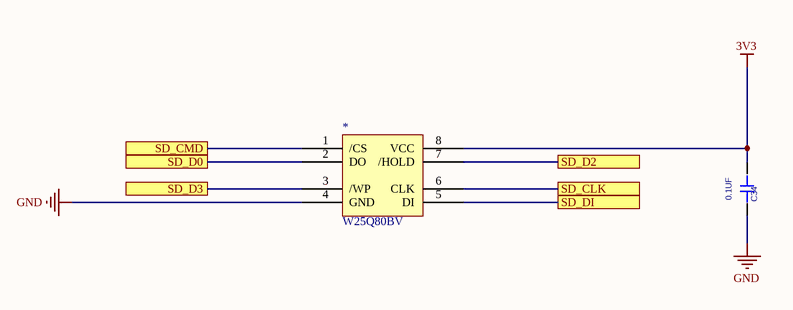
[diagram p9: 25Q80_SO.SchDoc]

### Parts
*  W25Q80BV  [W25Q80BV]
C34  value 0.1UF  [CAP_0603_FIRE]  (hidden comment: CAP_0.1UF_0603_FIRE)

### Ports
SD_CLK, SD_CMD, SD_D0, SD_D2, SD_D3, SD_DI

### Nets
3V3: *.8(VCC) C34.2
GND: *.4(GND) C34.1
Net*_1: *.1(/CS) ; port SD_CMD
Net*_2: *.2(DO) ; port SD_D0
Net*_3: *.3(/WP) ; port SD_D3
Net*_5: *.5(DI) ; port SD_DI
Net*_6: *.6(CLK) ; port SD_CLK
Net*_7: *.7(/HOLD) ; port SD_D2

### Library data of the parts
C34 = CAP_0.1UF_0603_FIRE: as C13 on sheet MainBoard; PCB DECAL: CAP_0603_FIRE

## Sheet DS18B20.SchDoc
size A4
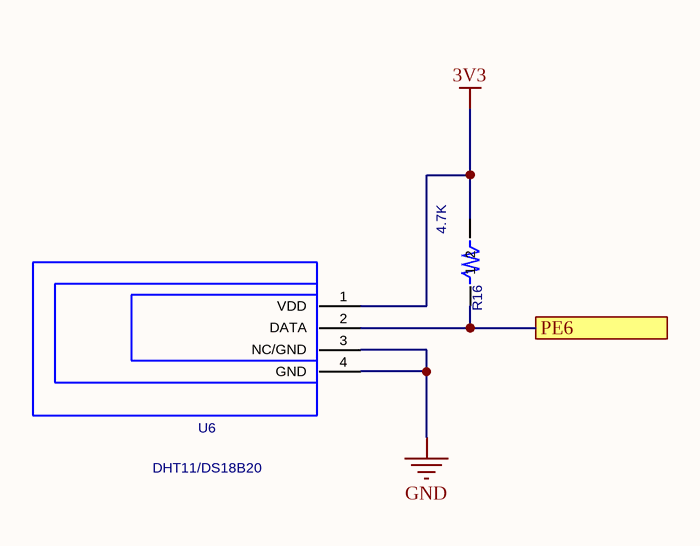
[diagram p10: DS18B20.SchDoc]

### Parts
R16  value 4.7K  [RES_0603_FIRE]  (hidden comment: RES_4K7_0603_FIRE)
U6  DHT11/DS18B20  [HDR1X4]

### Ports
PE6

### Nets
3V3: R16.2 U6.1(VDD)
GND: U6.3(NC/GND) U6.4(GND)
NetR16_1: R16.1 U6.2(DATA) ; port PE6

### Library data of the parts
R16 = RES_4K7_0603_FIRE: as R17 on sheet W25Q256; PCB DECAL: RES_0603_FIRE
U6 = DHT11/DS18B20: Manufacture 1 P/N: DHT11/DS1302; PCB DECAL: HDR1X4

## Sheet IR_Control.SchDoc
size A3
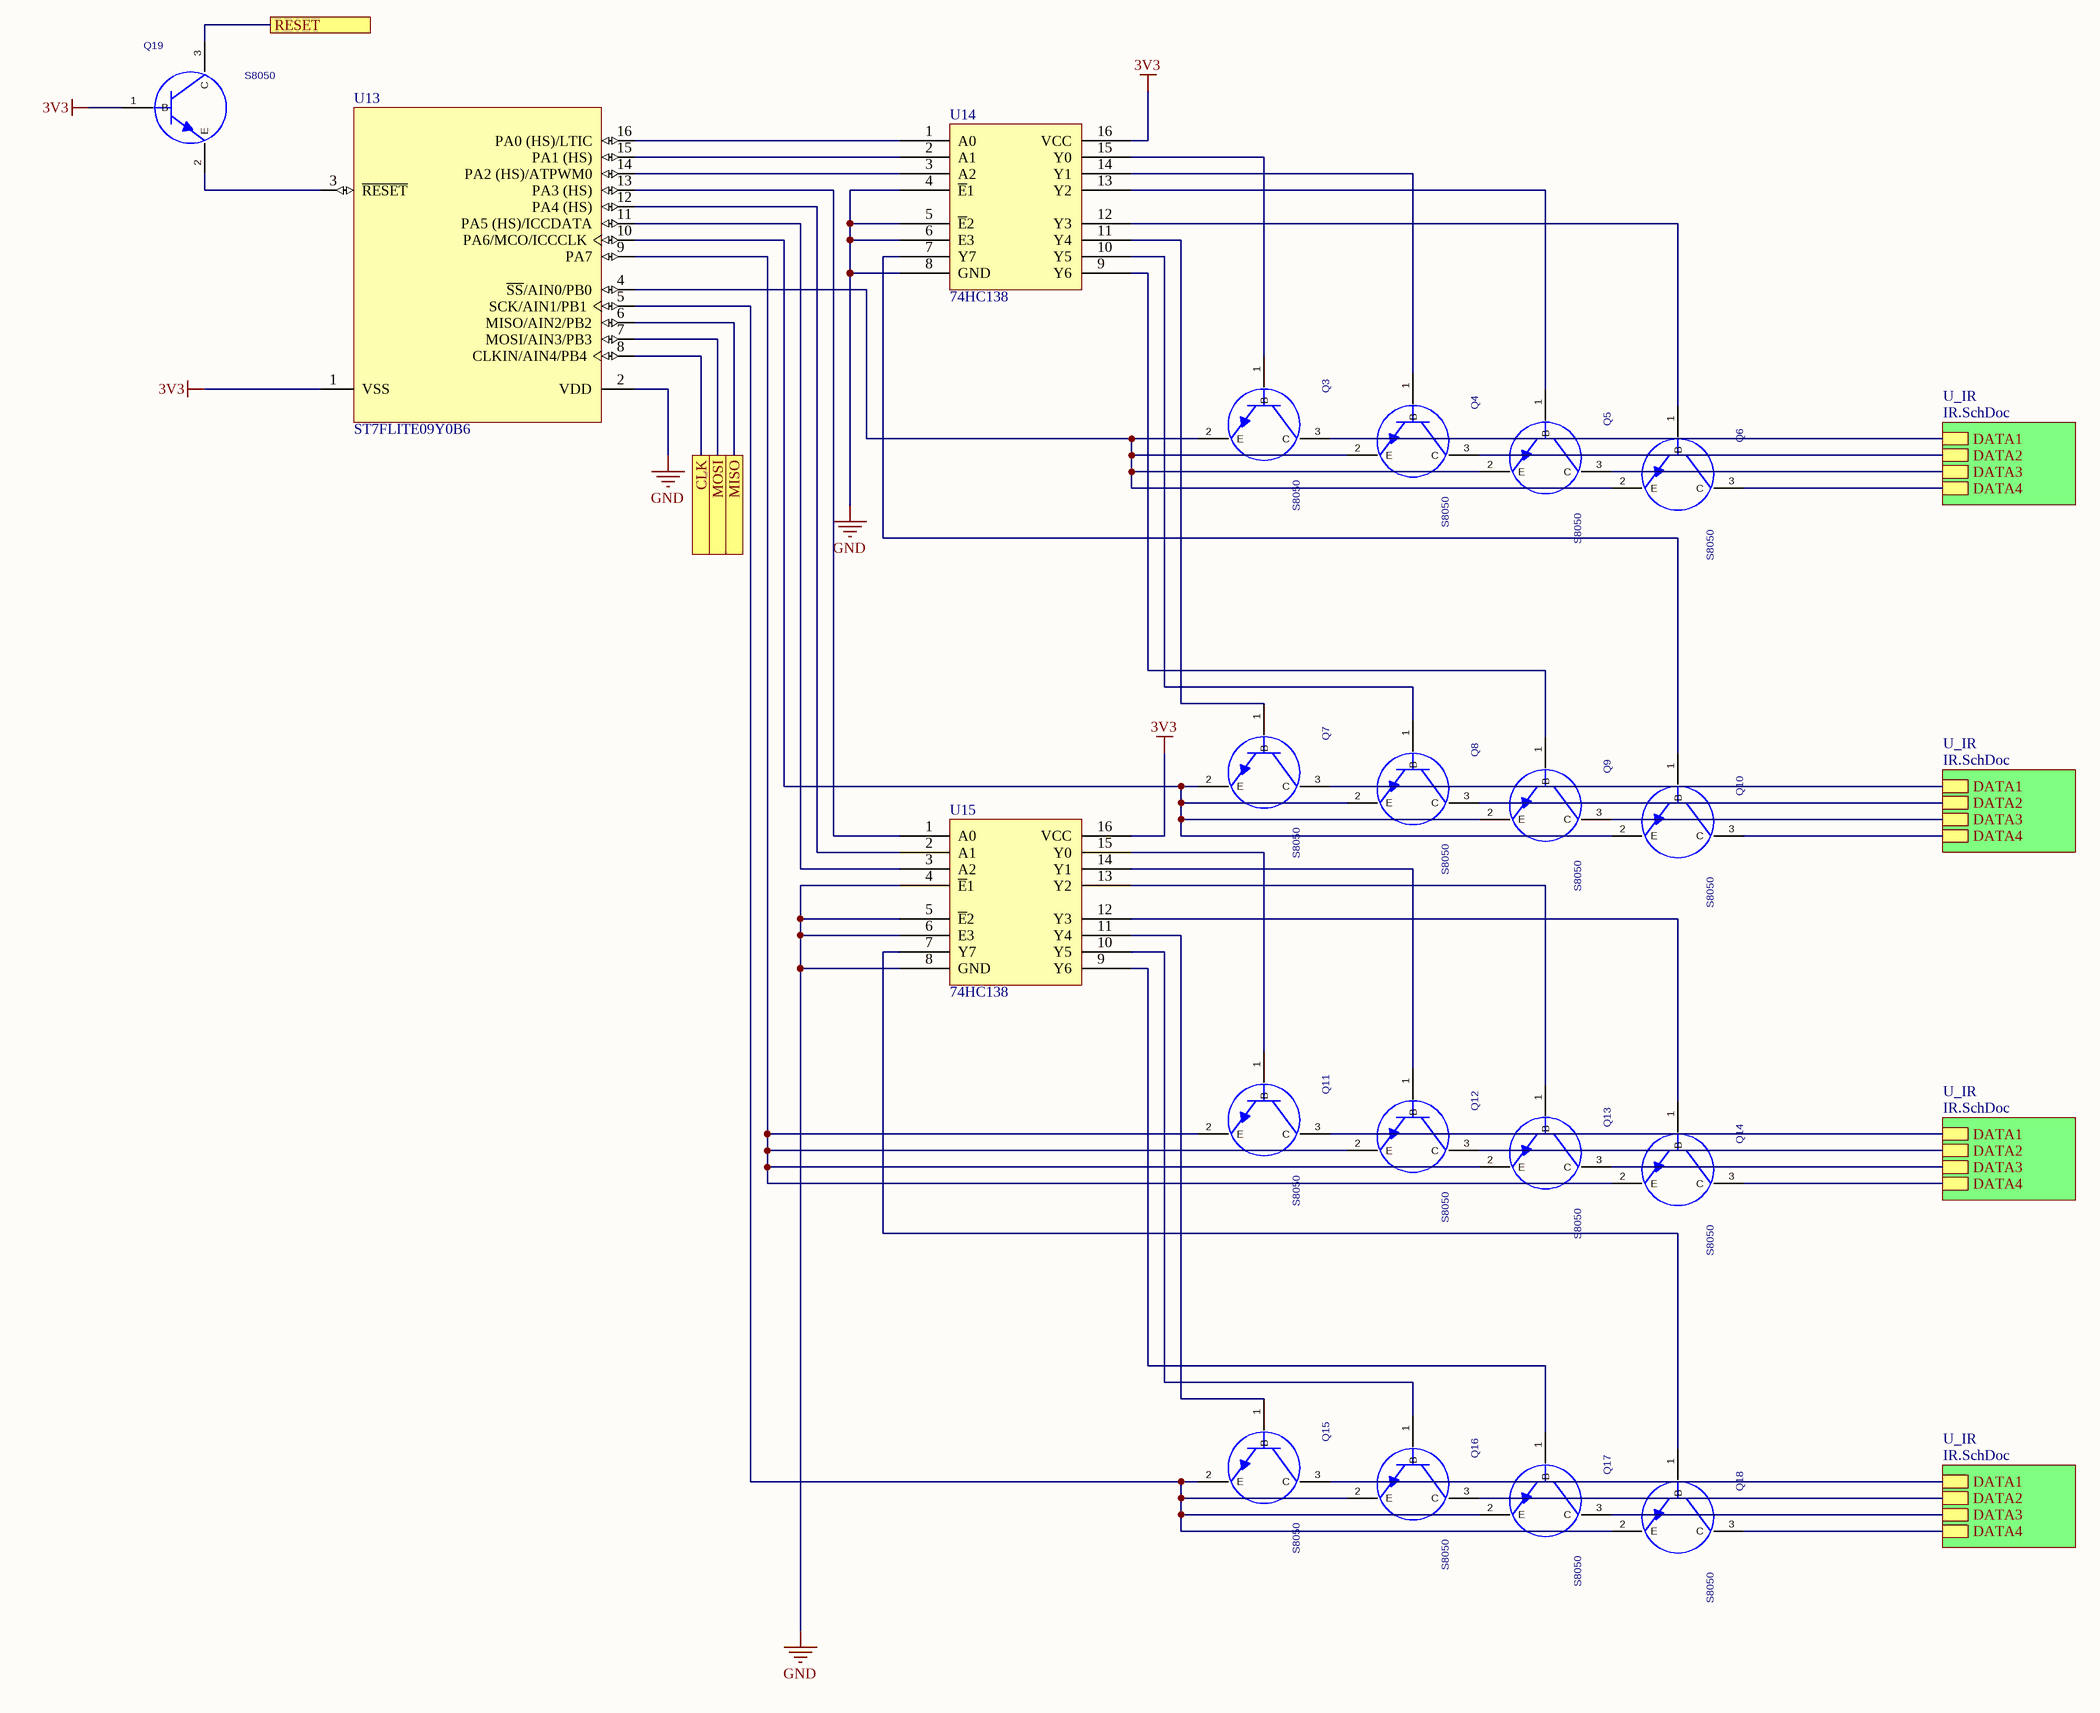
[diagram p11: IR_Control.SchDoc]

### Parts
Q3  S8050  [SOT-23]
Q4  S8050  [SOT-23]
Q5  S8050  [SOT-23]
Q6  S8050  [SOT-23]
Q7  S8050  [SOT-23]
Q8  S8050  [SOT-23]
Q9  S8050  [SOT-23]
Q10  S8050  [SOT-23]
Q11  S8050  [SOT-23]
Q12  S8050  [SOT-23]
Q13  S8050  [SOT-23]
Q14  S8050  [SOT-23]
Q15  S8050  [SOT-23]
Q16  S8050  [SOT-23]
Q17  S8050  [SOT-23]
Q18  S8050  [SOT-23]
Q19  S8050  [SOT-23]
U13  ST7FLITE09Y0B6  [PDIP16]
U14  74HC138  [74HC138]
U15  74HC138  [74HC138]

### Sub-sheets
U_IR = IR.SchDoc: DATA1, DATA2, DATA3, DATA4
U_IR = IR.SchDoc: DATA1, DATA2, DATA3, DATA4
U_IR = IR.SchDoc: DATA1, DATA2, DATA3, DATA4
U_IR = IR.SchDoc: DATA1, DATA2, DATA3, DATA4

### Ports
CLK, MISO, MOSI, RESET

### Nets
3V3: Q19.1(B) U13.1(VSS) U14.16(VCC) U15.16(VCC)
GND: U13.2(VDD) U14.4(~{E}1) U14.5(~{E}2) U14.6(E3) U14.8(GND) U15.4(~{E}1) U15.5(~{E}2) U15.6(E3) U15.8(GND)
IR_CLK: U13.8(CLKIN/AIN4/PB4) ; port CLK
IR_MISO: U13.6(MISO/AIN2/PB2) ; port MISO
IR_MOSI: U13.7(MOSI/AIN3/PB3) ; port MOSI
IR_RESET: Q19.3(C) ; port RESET
NetQ3_1: Q3.1(B) U14.15(Y0)
NetQ3_2: Q3.2(E) Q4.2(E) Q5.2(E) Q6.2(E) U13.4(~{SS}/AIN0/PB0)
NetQ3_3: Q3.3(C) ; sheet U_IR/DATA1
NetQ4_1: Q4.1(B) U14.14(Y1)
NetQ4_3: Q4.3(C) ; sheet U_IR/DATA2
NetQ5_1: Q5.1(B) U14.13(Y2)
NetQ5_3: Q5.3(C) ; sheet U_IR/DATA3
NetQ6_1: Q6.1(B) U14.12(Y3)
NetQ6_3: Q6.3(C) ; sheet U_IR/DATA4
NetQ7_1: Q7.1(B) U14.11(Y4)
NetQ7_2: Q7.2(E) Q8.2(E) Q9.2(E) Q10.2(E) U13.10(PA6/MCO/ICCCLK)
NetQ7_3: Q7.3(C) ; sheet U_IR/DATA1
NetQ8_1: Q8.1(B) U14.10(Y5)
NetQ8_3: Q8.3(C) ; sheet U_IR/DATA2
NetQ9_1: Q9.1(B) U14.9(Y6)
NetQ9_3: Q9.3(C) ; sheet U_IR/DATA3
NetQ10_1: Q10.1(B) U14.7(Y7)
NetQ10_3: Q10.3(C) ; sheet U_IR/DATA4
NetQ11_1: Q11.1(B) U15.15(Y0)
NetQ11_2: Q11.2(E) Q12.2(E) Q13.2(E) Q14.2(E) U13.9(PA7)
NetQ11_3: Q11.3(C) ; sheet U_IR/DATA1
NetQ12_1: Q12.1(B) U15.14(Y1)
NetQ12_3: Q12.3(C) ; sheet U_IR/DATA2
NetQ13_1: Q13.1(B) U15.13(Y2)
NetQ13_3: Q13.3(C) ; sheet U_IR/DATA3
NetQ14_1: Q14.1(B) U15.12(Y3)
NetQ14_3: Q14.3(C) ; sheet U_IR/DATA4
NetQ15_1: Q15.1(B) U15.11(Y4)
NetQ15_2: Q15.2(E) Q16.2(E) Q17.2(E) Q18.2(E) U13.5(SCK/AIN1/PB1)
NetQ15_3: Q15.3(C) ; sheet U_IR/DATA1
NetQ16_1: Q16.1(B) U15.10(Y5)
NetQ16_3: Q16.3(C) ; sheet U_IR/DATA2
NetQ17_1: Q17.1(B) U15.9(Y6)
NetQ17_3: Q17.3(C) ; sheet U_IR/DATA3
NetQ18_1: Q18.1(B) U15.7(Y7)
NetQ18_3: Q18.3(C) ; sheet U_IR/DATA4
NetQ19_2: Q19.2(E) U13.3(~{RESET})
NetU13_11: U13.11(PA5_(HS)/ICCDATA) U15.3(A2)
NetU13_12: U13.12(PA4_(HS)) U15.2(A1)
NetU13_13: U13.13(PA3_(HS)) U15.1(A0)
NetU13_14: U13.14(PA2_(HS)/ATPWM0) U14.3(A2)
NetU13_15: U13.15(PA1_(HS)) U14.2(A1)
NetU13_16: U13.16(PA0_(HS)/LTIC) U14.1(A0)

### Library data of the parts
Q3-Q19 = S8050: NPN; Manufacturer #2: 8050; PCB DECAL: SOT-23
U13 = ST7FLITE09Y0B6: 8-Bit MCU with 1.5k Single Voltage FLASH Memory, 128b RAM, Data EEPROM, 8-Bit ADC with Op-Amp, Timers and SPI, 16-Pin DIP; Note: Pins 4, 7, 9 and 16 are External Interrupt (EI) pins.; Published: 26-May-2004; LatestRevisionDate: 06-Jun-2005; LatestRevisionNote: Stylized 3D Model Added.; DatasheetVersion: rev2.5, Dec-2003; PackageVersion: Dec-2003; PackageReference: PDIP16; Publisher: Altium Limited; PackageDescription: DIP; 16 Leads; Row Spacing 7.62 mm; Pitch 2.54 mm; ComponentLink1Description: Manufacturer Link; ComponentLink1URL: http://www.st.com/; ComponentLink2Description: Datasheet; ComponentLink2URL: http://www.st.com/stonline/products/literature/ds/8348/st7lite0.pdf

## Sheet IR.SchDoc
size A4
Used 4 times, as channels U_IR_Control/U_IR, U_IR_Control/U_IR, U_IR_Control/U_IR, U_IR_Control/U_IR. Parts and nets are listed once, with the designators drawn on the sheet.
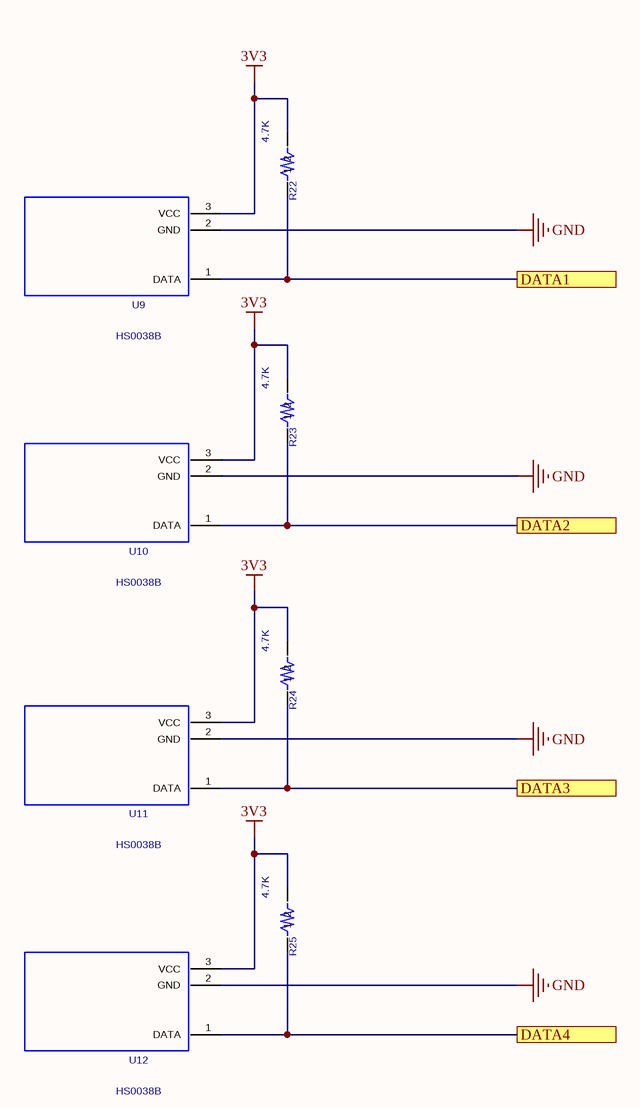
[diagram p12: IR.SchDoc]

### Parts
R22  value 4.7K  [RES_0603_FIRE]  (hidden comment: RES_4K7_0603_FIRE)
R23  value 4.7K  [RES_0603_FIRE]  (hidden comment: RES_4K7_0603_FIRE)
R24  value 4.7K  [RES_0603_FIRE]  (hidden comment: RES_4K7_0603_FIRE)
R25  value 4.7K  [RES_0603_FIRE]  (hidden comment: RES_4K7_0603_FIRE)
U9  HS0038B  [HDR1X3]
U10  HS0038B  [HDR1X3]
U11  HS0038B  [HDR1X3]
U12  HS0038B  [HDR1X3]

### Ports
DATA1, DATA2, DATA3, DATA4

### Nets
3V3: R22.2 R23.2 R24.2 R25.2 U9.3(VCC) U10.3(VCC) U11.3(VCC) U12.3(VCC)
GND: U9.2(GND) U10.2(GND) U11.2(GND) U12.2(GND)
DATA1: R22.1 U9.1(DATA) ; port DATA1
DATA2: R23.1 U10.1(DATA) ; port DATA2
DATA3: R24.1 U11.1(DATA) ; port DATA3
DATA4: R25.1 U12.1(DATA) ; port DATA4

### Channels
U_IR_Control/U_IR: designators end in _U_IR_Control_U_IR#1; ports DATA1=NetQ3_3 DATA2=NetQ4_3 DATA3=NetQ5_3 DATA4=NetQ6_3
U_IR_Control/U_IR: designators end in _U_IR_Control_U_IR#2; ports DATA1=NetQ7_3 DATA2=NetQ8_3 DATA3=NetQ9_3 DATA4=NetQ10_3
U_IR_Control/U_IR: designators end in _U_IR_Control_U_IR#3; ports DATA1=NetQ11_3 DATA2=NetQ12_3 DATA3=NetQ13_3 DATA4=NetQ14_3
U_IR_Control/U_IR: designators end in _U_IR_Control_U_IR#4; ports DATA1=NetQ15_3 DATA2=NetQ16_3 DATA3=NetQ17_3 DATA4=NetQ18_3

### Library data of the parts
R22-R25 = RES_4K7_0603_FIRE: as R17 on sheet W25Q256; PCB DECAL: RES_0603_FIRE
U9-U12 = HS0038B: Geometry.Height: 1.19990mm; Protel.FootprintDescription: Connector; Header; 3 Position; Manufacture 1 P/N: HS0038B; PCB DECAL: HDR1X3

## Sheet MotorControl.SchDoc
size A4
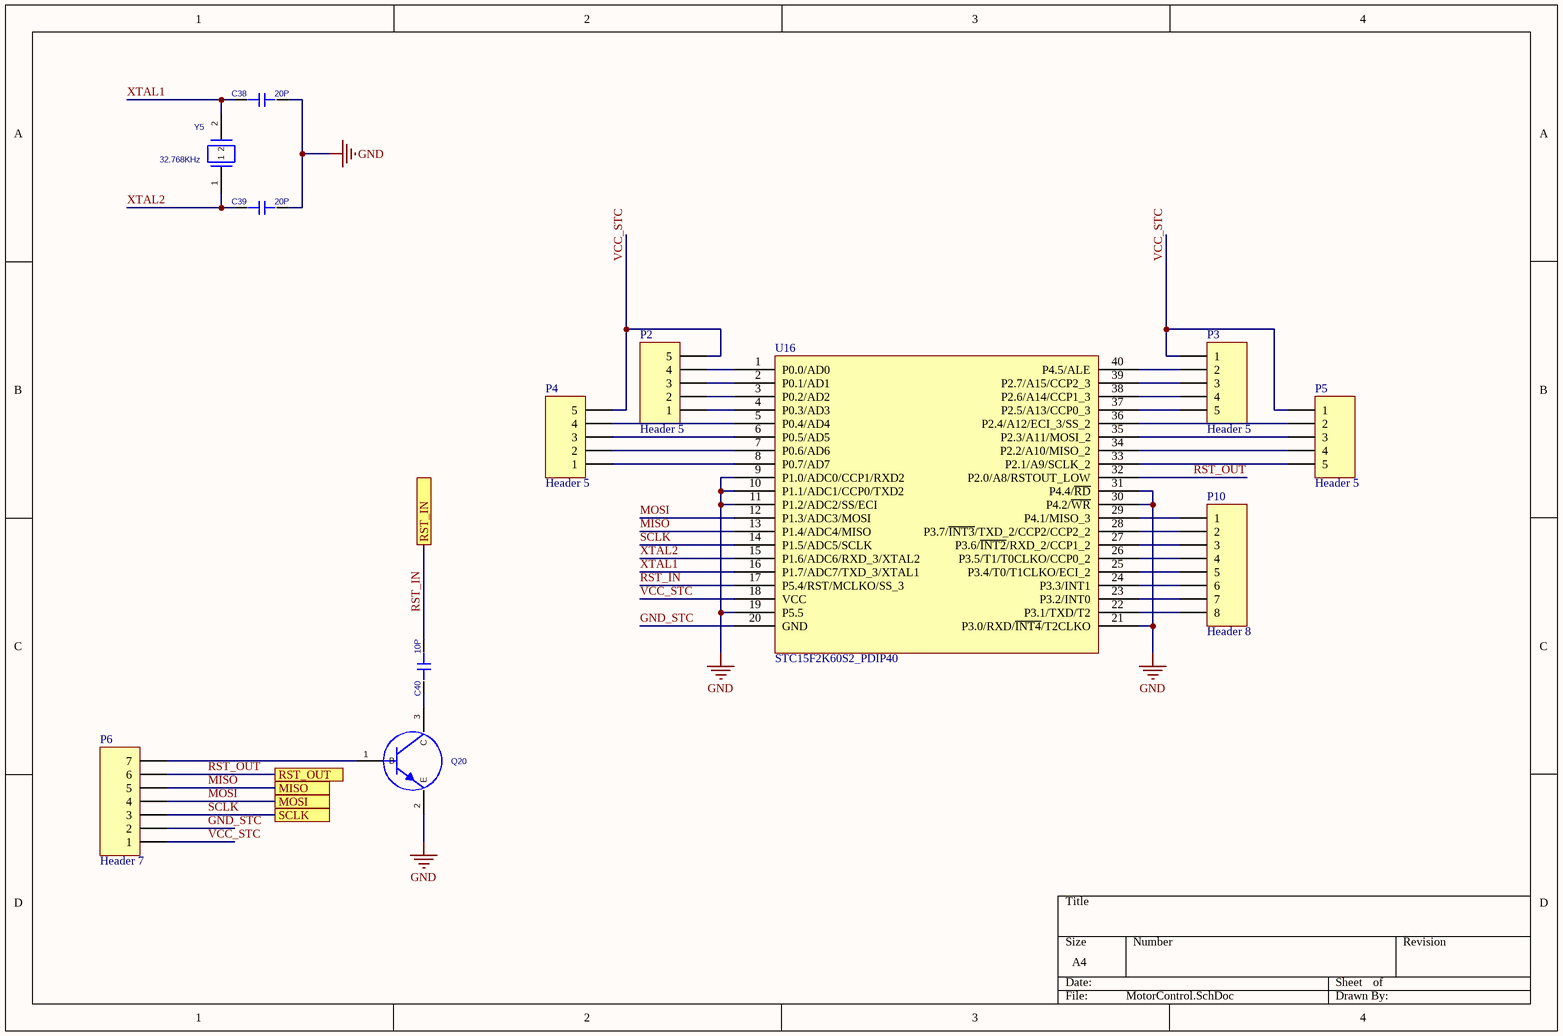
[diagram p13: MotorControl.SchDoc]

### Parts
C38  value 20P  [CAP_0603_FIRE]  (hidden comment: CAP_20P_0603_FIRE)
C39  value 20P  [CAP_0603_FIRE]  (hidden comment: CAP_20P_0603_FIRE)
C40  value 10P  [RES_0603_FIRE]  (hidden comment: CAP_10P_0603_FIRE)
P2  Header 5  [HDR1X5]
P3  Header 5  [HDR1X5]
P4  Header 5  [HDR1X5]
P5  Header 5  [HDR1X5]
P6  Header 7
P10  Header 8  [HDR1X8]
Q20  8050  [SOT-23]  (value not drawn)
U16  STC15F2K60S2_PDIP40  [DIP40]
Y5  value 32.768KHz  [3215]  (hidden comment: XTAL_32.768KHZ_3215)

### Ports
MISO, MOSI, RST_IN, RST_OUT, SCLK

### Nets
GND: C38.2 C39.2 Q20.2(E) U16.9(P1.0/ADC0/CCP1/RXD2) U16.10(P1.1/ADC1/CCP0/TXD2) U16.11(P1.2/ADC2/SS/ECI) U16.19(P5.5) U16.21(P3.0/RXD/~{INT4}/T2CLKO) U16.30(P4.2/~{WR}) U16.31(P4.4/~{RD})
GND_STC: P6.2 U16.20(GND)
MISO: P6.5 U16.13(P1.4/ADC4/MISO) ; port MISO  [project net MC_MISO]
MOSI: P6.4 U16.12(P1.3/ADC3/MOSI) ; port MOSI  [project net MC_MOSI]
RST_IN: C40.2 U16.17(P5.4/RST/MCLKO/SS_3) ; port RST_IN  [project net MC_RST_IN]
RST_OUT: P6.6 U16.32(P2.0/A8/RSTOUT_LOW) ; port RST_OUT  [project net MC_RST_OUT]
SCLK: P6.3 U16.14(P1.5/ADC5/SCLK) ; port SCLK  [project net MC_SCLK]
VCC_STC: P2.5 P3.1 P4.5 P5.1 P6.1 U16.18(VCC)
XTAL1: C38.1 U16.16(P1.7/ADC7/TXD_3/XTAL1) Y5.2
XTAL2: C39.1 U16.15(P1.6/ADC6/RXD_3/XTAL2) Y5.1
NetC40_1: C40.1 Q20.3(C)
NetP2_1: P2.1 U16.4(P0.3/AD3)
NetP2_2: P2.2 U16.3(P0.2/AD2)
NetP2_3: P2.3 U16.2(P0.1/AD1)
NetP2_4: P2.4 U16.1(P0.0/AD0)
NetP3_2: P3.2 U16.40(P4.5/ALE)
NetP3_3: P3.3 U16.39(P2.7/A15/CCP2_3)
NetP3_4: P3.4 U16.38(P2.6/A14/CCP1_3)
NetP3_5: P3.5 U16.37(P2.5/A13/CCP0_3)
NetP4_1: P4.1 U16.8(P0.7/AD7)
NetP4_2: P4.2 U16.7(P0.6/AD6)
NetP4_3: P4.3 U16.6(P0.5/AD5)
NetP4_4: P4.4 U16.5(P0.4/AD4)
NetP5_2: P5.2 U16.36(P2.4/A12/ECI_3/SS_2)
NetP5_3: P5.3 U16.35(P2.3/A11/MOSI_2)
NetP5_4: P5.4 U16.34(P2.2/A10/MISO_2)
NetP5_5: P5.5 U16.33(P2.1/A9/SCLK_2)
NetP6_7: P6.7 Q20.1(B)
NetP10_1: P10.1 U16.29(P4.1/MISO_3)
NetP10_2: P10.2 U16.28(P3.7/~{INT3}/TXD_2/CCP2/CCP2_2)
NetP10_3: P10.3 U16.27(P3.6/~{INT2}/RXD_2/CCP1_2)
NetP10_4: P10.4 U16.26(P3.5/T1/T0CLKO/CCP0_2)
NetP10_5: P10.5 U16.25(P3.4/T0/T1CLKO/ECI_2)
NetP10_6: P10.6 U16.24(P3.3/INT1)
NetP10_7: P10.7 U16.23(P3.2/INT0)
NetP10_8: P10.8 U16.22(P3.1/TXD/T2)

### Library data of the parts
C40 = CAP_10P_0603_FIRE: as C1 on sheet OSC&RESET; PCB DECAL: RES_0603_FIRE
P2-P5 = Header 5: Header, 5-Pin; LatestRevisionDate: 17-Jul-2002; LatestRevisionNote: Re-released for DXP Platform.; Publisher: Altium Limited
P6 = Header 7: Header, 7-Pin; LatestRevisionDate: 17-Jul-2002; LatestRevisionNote: Re-released for DXP Platform.; Publisher: Altium Limited
P10 = Header 8: Header, 8-Pin; LatestRevisionDate: 17-Jul-2002; LatestRevisionNote: Re-released for DXP Platform.; Publisher: Altium Limited
Q20 = 8050: NPN; Manufacturer #2: 8050; PCB DECAL: SOT-23
Y5 = XTAL_32.768KHZ_3215: CRYSTAL; PCB DECAL: 3215
C38 C39 = CAP_20P_0603_FIRE: PCB DECAL: CAP_0603_FIRE

## Sheet SonarControl.SchDoc
size A4
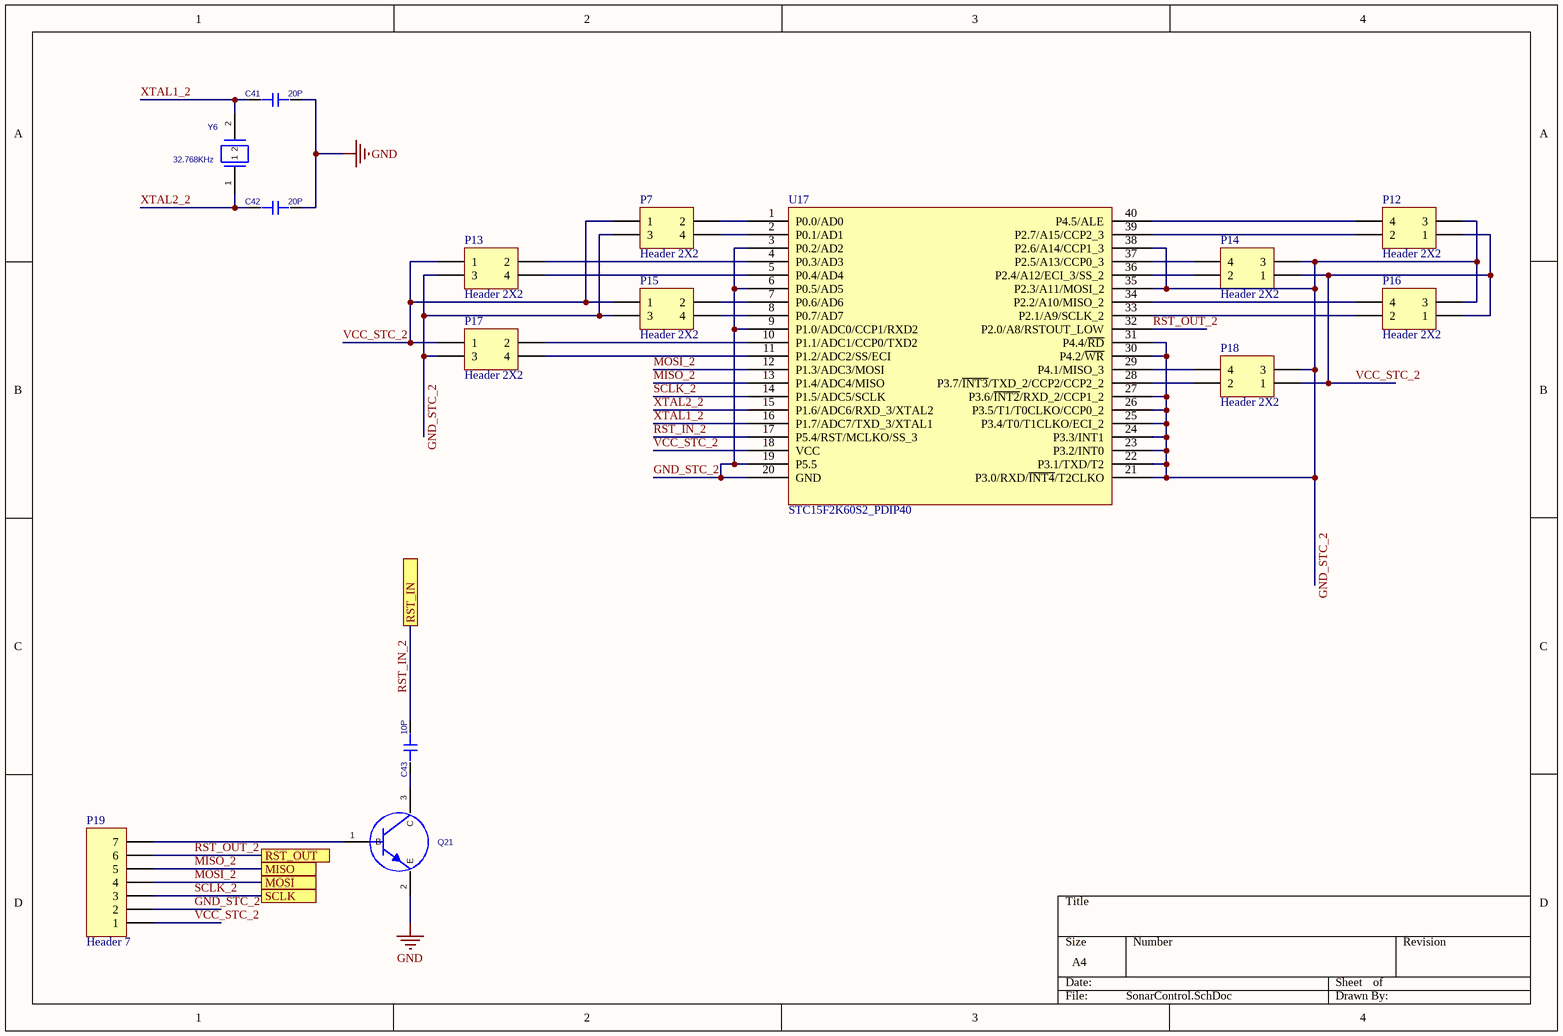
[diagram p14: SonarControl.SchDoc]

### Parts
C41  value 20P  [CAP_0603_FIRE]  (hidden comment: CAP_20P_0603_FIRE)
C42  value 20P  [CAP_0603_FIRE]  (hidden comment: CAP_20P_0603_FIRE)
C43  value 10P  [RES_0603_FIRE]  (hidden comment: CAP_10P_0603_FIRE)
P7  Header 2X2  [HDR2X2]
P12  Header 2X2  [HDR2X2]
P13  Header 2X2  [HDR2X2]
P14  Header 2X2  [HDR2X2]
P15  Header 2X2  [HDR2X2]
P16  Header 2X2  [HDR2X2]
P17  Header 2X2  [HDR2X2]
P18  Header 2X2  [HDR2X2]
P19  Header 7
Q21  8050  [SOT-23]  (value not drawn)
U17  STC15F2K60S2_PDIP40  [DIP40]
Y6  value 32.768KHz  [3215]  (hidden comment: XTAL_32.768KHZ_3215)

### Ports
MISO, MOSI, RST_IN, RST_OUT, SCLK

### Nets
GND: C41.2 C42.2 Q21.2(E)
GND_STC_2: P7.3 P12.3 P13.3 P14.3 P15.3 P16.3 P17.3 P18.3 P19.2 U17.3(P0.2/AD2) U17.6(P0.5/AD5) U17.9(P1.0/ADC0/CCP1/RXD2) U17.19(P5.5) U17.20(GND) U17.21(P3.0/RXD/~{INT4}/T2CLKO) U17.22(P3.1/TXD/T2) U17.23(P3.2/INT0) U17.24(P3.3/INT1) U17.25(P3.4/T0/T1CLKO/ECI_2) U17.26(P3.5/T1/T0CLKO/CCP0_2) U17.27(P3.6/~{INT2}/RXD_2/CCP1_2) U17.30(P4.2/~{WR}) U17.31(P4.4/~{RD}) U17.35(P2.3/A11/MOSI_2) U17.38(P2.6/A14/CCP1_3)
MISO_2: P19.5 U17.13(P1.4/ADC4/MISO) ; port MISO
MOSI_2: P19.4 U17.12(P1.3/ADC3/MOSI) ; port MOSI
RST_IN_2: C43.2 U17.17(P5.4/RST/MCLKO/SS_3) ; port RST_IN
RST_OUT_2: P19.6 U17.32(P2.0/A8/RSTOUT_LOW) ; port RST_OUT
SCLK_2: P19.3 U17.14(P1.5/ADC5/SCLK) ; port SCLK  [project net SC_SCLK]
VCC_STC_2: P7.1 P12.1 P13.1 P14.1 P15.1 P16.1 P17.1 P18.1 P19.1 U17.18(VCC)
XTAL1_2: C41.1 U17.16(P1.7/ADC7/TXD_3/XTAL1) Y6.2
XTAL2_2: C42.1 U17.15(P1.6/ADC6/RXD_3/XTAL2) Y6.1
NetC43_1: C43.1 Q21.3(C)
NetP7_2: P7.2 U17.1(P0.0/AD0)
NetP7_4: P7.4 U17.2(P0.1/AD1)
NetP12_2: P12.2 U17.39(P2.7/A15/CCP2_3)
NetP12_4: P12.4 U17.40(P4.5/ALE)
NetP13_2: P13.2 U17.4(P0.3/AD3)
NetP13_4: P13.4 U17.5(P0.4/AD4)
NetP14_2: P14.2 U17.36(P2.4/A12/ECI_3/SS_2)
NetP14_4: P14.4 U17.37(P2.5/A13/CCP0_3)
NetP15_2: P15.2 U17.7(P0.6/AD6)
NetP15_4: P15.4 U17.8(P0.7/AD7)
NetP16_2: P16.2 U17.33(P2.1/A9/SCLK_2)
NetP16_4: P16.4 U17.34(P2.2/A10/MISO_2)
NetP17_2: P17.2 U17.10(P1.1/ADC1/CCP0/TXD2)
NetP17_4: P17.4 U17.11(P1.2/ADC2/SS/ECI)
NetP18_2: P18.2 U17.28(P3.7/~{INT3}/TXD_2/CCP2/CCP2_2)
NetP18_4: P18.4 U17.29(P4.1/MISO_3)
NetP19_7: P19.7 Q21.1(B)

### Library data of the parts
C43 = CAP_10P_0603_FIRE: as C1 on sheet OSC&RESET; PCB DECAL: RES_0603_FIRE
P7 P12-P18 = Header 2X2: Header, 2-Pin, Dual row; LatestRevisionDate: 17-Jul-2002; LatestRevisionNote: Re-released for DXP Platform.; Publisher: Altium Limited
P19 = Header 7: Header, 7-Pin; LatestRevisionDate: 17-Jul-2002; LatestRevisionNote: Re-released for DXP Platform.; Publisher: Altium Limited
Q21 = 8050: NPN; Manufacturer #2: 8050; PCB DECAL: SOT-23
Y6 = XTAL_32.768KHZ_3215: CRYSTAL; PCB DECAL: 3215
C41 C42 = CAP_20P_0603_FIRE: PCB DECAL: CAP_0603_FIRE

## Sheet SD_Card.SchDoc
size A4
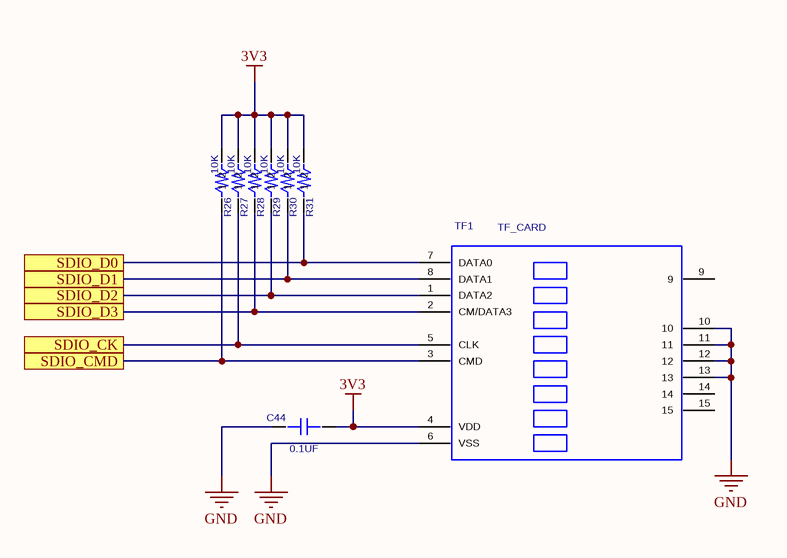
[diagram p15: SD_Card.SchDoc]

### Parts
C44  value 0.1UF  [CAP_0603_FIRE]  (hidden comment: CAP_0.1UF_0603_FIRE)
R26  value 10K  [RES_0603_FIRE]  (hidden comment: RES_10K_0603_FIRE)
R27  value 10K  [RES_0603_FIRE]  (hidden comment: RES_10K_0603_FIRE)
R28  value 10K  [RES_0603_FIRE]  (hidden comment: RES_10K_0603_FIRE)
R29  value 10K  [RES_0603_FIRE]  (hidden comment: RES_10K_0603_FIRE)
R30  value 10K  [RES_0603_FIRE]  (hidden comment: RES_10K_0603_FIRE)
R31  value 10K  [RES_0603_FIRE]  (hidden comment: RES_10K_0603_FIRE)
TF1  TF_CARD  [TF_CARD]

### Ports
SDIO_CK, SDIO_CMD, SDIO_D0, SDIO_D1, SDIO_D2, SDIO_D3

### Nets
3V3: C44.1 R26.2 R27.2 R28.2 R29.2 R30.2 R31.2 TF1.4(VDD)
GND: C44.2 TF1.6(VSS) TF1.10 TF1.11 TF1.12 TF1.13
NetR26_1: R26.1 TF1.3(CMD) ; port SDIO_CMD
NetR27_1: R27.1 TF1.5(CLK) ; port SDIO_CK
NetR28_1: R28.1 TF1.2(CM/DATA3) ; port SDIO_D3
NetR29_1: R29.1 TF1.1(DATA2) ; port SDIO_D2
NetR30_1: R30.1 TF1.8(DATA1) ; port SDIO_D1
NetR31_1: R31.1 TF1.7(DATA0) ; port SDIO_D0

Not connected (* = marked no-connect by the designer): TF1 9 14 15

### Library data of the parts
C44 = CAP_0.1UF_0603_FIRE: as C13 on sheet MainBoard; PCB DECAL: CAP_0603_FIRE
R26-R31 = RES_10K_0603_FIRE: as R3 on sheet MainBoard; PCB DECAL: RES_0603_FIRE
TF1 = TF_CARD: Manufacturer #1 PN: MicroSD座/手机; PCB DECAL: TF_CARD

## Sheet DS12885.SchDoc
size A4
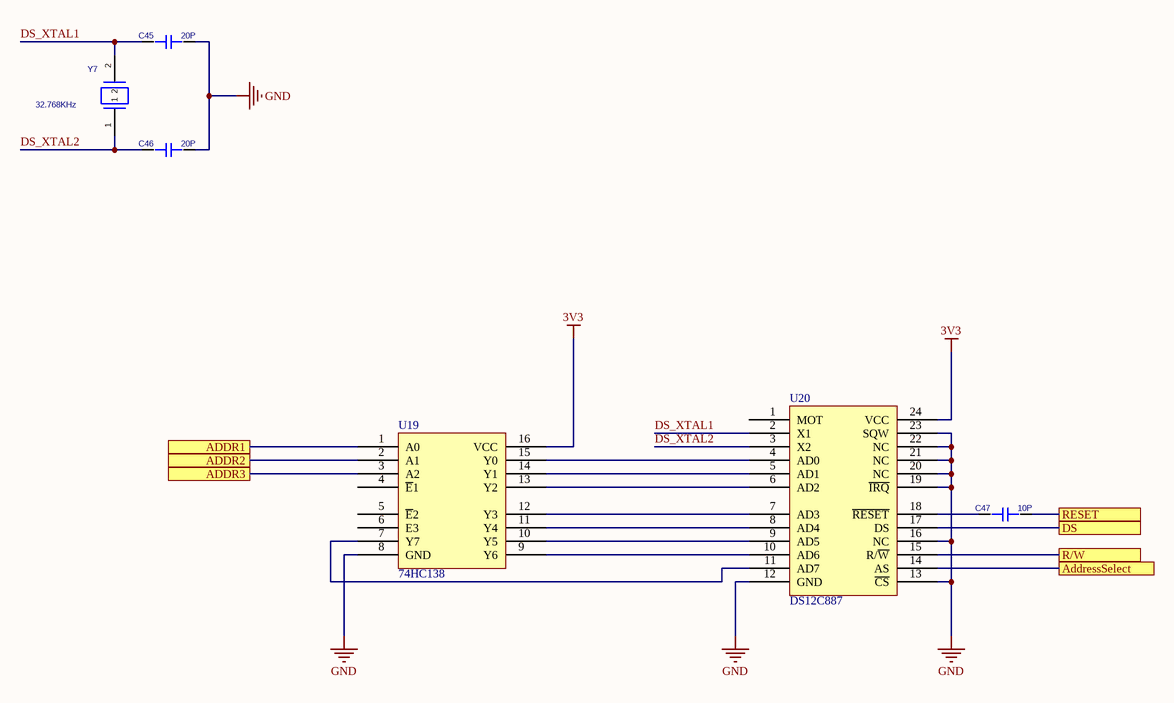
[diagram p16: DS12885.SchDoc]

### Parts
C45  value 20P  [CAP_0603_FIRE]  (hidden comment: CAP_20P_0603_FIRE)
C46  value 20P  [CAP_0603_FIRE]  (hidden comment: CAP_20P_0603_FIRE)
C47  value 10P  [RES_0603_FIRE]  (hidden comment: CAP_10P_0603_FIRE)
U19  74HC138  [74HC138]
U20  DS12C887  [DS12885]
Y7  value 32.768KHz  [3215]  (hidden comment: XTAL_32.768KHZ_3215)

### Ports
ADDR1, ADDR2, ADDR3, AddressSelect, DS, R/W, RESET

### Nets
3V3: U19.16(VCC) U20.24(VCC)
GND: C45.2 C46.2 U19.8(GND) U20.12(GND) U20.13(~{CS}) U20.16(NC) U20.19(~{IRQ}) U20.20(NC) U20.21(NC) U20.22(NC) U20.23(SQW)
DS_XTAL1: C45.1 U20.2(X1) Y7.2
DS_XTAL2: C46.1 U20.3(X2) Y7.1
NetC47_1: C47.1 U20.18(~{RESET})
NetC47_2: C47.2 ; port RESET
NetU1_34: U20.17(DS) ; port DS
NetU1_63: U20.15(R/~{W}) ; port R/W
NetU1_64: U20.14(AS) ; port AddressSelect
NetU1_66: U19.3(A2) ; port ADDR3
NetU1_78: U19.2(A1) ; port ADDR2
NetU1_79: U19.1(A0) ; port ADDR1
NetU19_7: U19.7(Y7) U20.11(AD7)
NetU19_9: U19.9(Y6) U20.10(AD6)
NetU19_10: U19.10(Y5) U20.9(AD5)
NetU19_11: U19.11(Y4) U20.8(AD4)
NetU19_12: U19.12(Y3) U20.7(AD3)
NetU19_13: U19.13(Y2) U20.6(AD2)
NetU19_14: U19.14(Y1) U20.5(AD1)
NetU19_15: U19.15(Y0) U20.4(AD0)

Not connected (* = marked no-connect by the designer): U19 4(~{E}1) 5(~{E}2) 6(E3); U20 1(MOT)

### Library data of the parts
C47 = CAP_10P_0603_FIRE: as C1 on sheet OSC&RESET; PCB DECAL: RES_0603_FIRE
Y7 = XTAL_32.768KHZ_3215: CRYSTAL; PCB DECAL: 3215
C45 C46 = CAP_20P_0603_FIRE: PCB DECAL: CAP_0603_FIRE

## Sheet PowerUnit.SchDoc
size A4
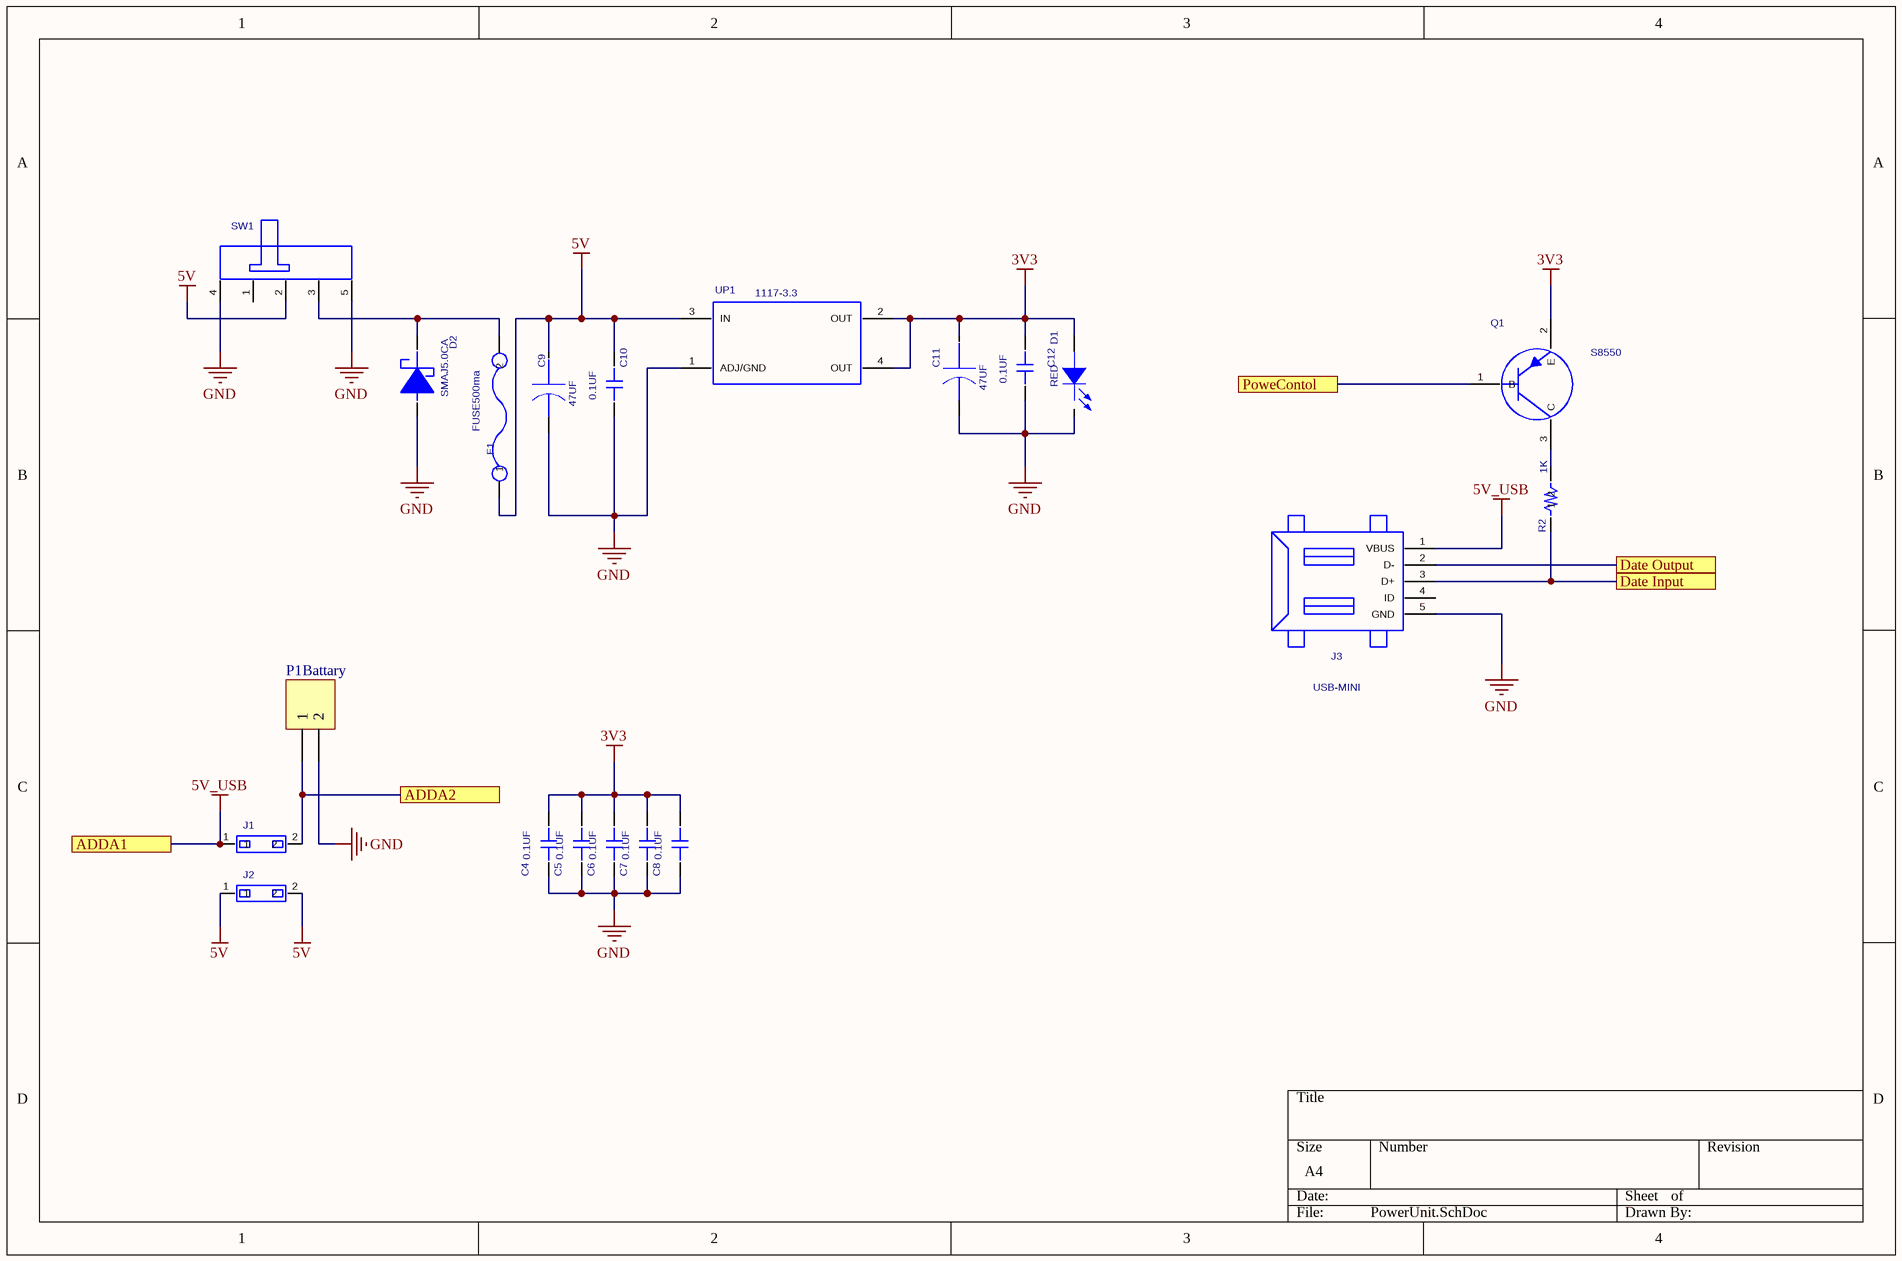
[diagram p17: PowerUnit.SchDoc]

### Parts
C4  value 0.1UF  [CAP_0603_FIRE]  (hidden comment: CAP_0.1UF_0603_FIRE)
C5  value 0.1UF  [CAP_0603_FIRE]  (hidden comment: CAP_0.1UF_0603_FIRE)
C6  value 0.1UF  [CAP_0603_FIRE]  (hidden comment: CAP_0.1UF_0603_FIRE)
C7  value 0.1UF  [CAP_0603_FIRE]  (hidden comment: CAP_0.1UF_0603_FIRE)
C8  value 0.1UF  [CAP_0603_FIRE]  (hidden comment: CAP_0.1UF_0603_FIRE)
C9  value 47UF  [CAP+_47UF_FIRE]  (hidden comment: CAP+_47UF_FIRE)
C10  value 0.1UF  [CAP_0603_FIRE]  (hidden comment: CAP_0.1UF_0603_FIRE)
C11  value 47UF  [CAP+_47UF_FIRE]  (hidden comment: CAP+_47UF_FIRE)
C12  value 0.1UF  [CAP_0603_FIRE]  (hidden comment: CAP_0.1UF_0603_FIRE)
D1  value RED  [LED_RED_0603_FIRE]  (hidden comment: LED_RED_0603_FIRE)
D2  SMAJ5.0CA  [DO-214]
F1  FUSE500MA  [C1812]
J1  1X2PIN_SMD  [1X2PIN_SMD]  (value not drawn)
J2  1X2PIN_SMD  [1X2PIN_SMD]  (value not drawn)
J3  USB-MINI  [USB-MINI]
P1  Battary  [HDR1X2]
Q1  S8550  [SOT-23]
R2  value 1K  [RES_0603_FIRE]  (hidden comment: RES_1K_0603_FIRE)
SW1  SW-POWER  [SW13_6]  (value not drawn)
UP1  1117-3.3

### Ports
ADDA1, ADDA2, Date Input, Date Output, PoweContol

### Nets
3V3: C4.2 C5.2 C6.2 C7.2 C8.2 C11.1 C12.2 D1.A(ANODE) Q1.2(E) UP1.2(OUT) UP1.4(OUT)
5V: C9.1 C10.2 F1.1 J2.1 J2.2 SW1.2 UP1.3(IN)
5V_USB: J1.1 J3.1(VBUS) ; port ADDA1  [project net ADDA2]
GND: C4.1 C5.1 C6.1 C7.1 C8.1 C9.2 C10.1 C11.2 C12.1 D1.K(CATHODE) D2.1(+) J3.5(GND) P1.2 SW1.4 SW1.5 UP1.1(ADJ/GND)
ADDA1: J1.2 P1.1 ; port ADDA2
NetD2_2: D2.2(-) F1.2 SW1.3
NetJ3_2: J3.2(D-) ; port Date Output
NetJ3_3: J3.3(D+) R2.1 ; port Date Input
NetQ1_1: Q1.1(B) ; port PoweContol
NetQ1_3: Q1.3(C) R2.2

Not connected (* = marked no-connect by the designer): J3 4(ID); SW1 1

### Library data of the parts
C4-C8 C10 C12 = CAP_0.1UF_0603_FIRE: as C13 on sheet MainBoard; PCB DECAL: CAP_0603_FIRE
D1 = LED_RED_0603_FIRE: red,0805; PCB DECAL: LED_RED_0603_FIRE
F1 = FUSE500MA: Assembly: SMD; Protel.FootprintDescription: Chip Capacitor, 2-Leads, Body 4.6x3.2mm, IP; Manufacture 1 P/N: FUSE500ma; Value: FUSE500ma; PCB DECAL: C1812
P1 = Header 2: Header, 2-Pin; LatestRevisionDate: 17-Jul-2002; LatestRevisionNote: Re-released for DXP Platform.; Publisher: Altium Limited
Q1 = S8550: NPN; Manufacturer #2: 8050; PCB DECAL: SOT-23
R2 = RES_1K_0603_FIRE: as R18 on sheet ESP8266; PCB DECAL: RES_0603_FIRE
SW1 = SW-POWER: SW-5; Manufacturer #1 PN: SW-5; PCB DECAL: SW13_6
UP1 = 1117-3.3: SOT-223; Manufacturer #1: SPX; Geometry.Height: 62.99mil; Manufacturer #1 PN: 1117-3.3
C9 C11 = CAP+_47UF_FIRE: PCB DECAL: CAP+_47UF_FIRE
D2 = SMAJ5.0CA: Value: SMAJ5.0CA; PCB DECAL: DO-214
J1 J2 = 1X2PIN_SMD: PCB DECAL: 1X2PIN_SMD
J3 = USB-MINI: PCB DECAL: USB-MINI

## Nets that join several sheets
3V3: MainBoard (16 pins), OSC&RESET (R1.2), OV7725 (L3.1), W25Q256 (R17.2), ESP8266 (8 pins), 25Q80_SO (*.8 C34.2), DS18B20 (R16.2 U6.1), IR_Control (Q19.1 U13.1 U14.16 U15.16), U_IR_Control/U_IR (8 pins), U_IR_Control/U_IR (8 pins), U_IR_Control/U_IR (8 pins), U_IR_Control/U_IR (8 pins), SD_Card (8 pins), DS12885 (U19.16 U20.24), PowerUnit (11 pins)
ADDA2: MainBoard (U1.16), PowerUnit (J1.1 J3.1)
GND: MainBoard (30 pins), OSC&RESET (5 pins), OV7725 (20 pins), OV7725_CRYSTAL (Y3.1 Y3.2), AL422B (16 pins), SN74LVC1G00 (C27.1 U4.1 U4.3), W25Q256 (9 pins), ESP8266 (16 pins), 25Q80_SO (*.4 C34.1), DS18B20 (U6.3 U6.4), IR_Control (9 pins), U_IR_Control/U_IR (U9_U_IR_Control_U_IR#1.2 U10_U_IR_Control_U_IR#1.2 U11_U_IR_Control_U_IR#1.2 U12_U_IR_Control_U_IR#1.2), U_IR_Control/U_IR (U9_U_IR_Control_U_IR#2.2 U10_U_IR_Control_U_IR#2.2 U11_U_IR_Control_U_IR#2.2 U12_U_IR_Control_U_IR#2.2), U_IR_Control/U_IR (U9_U_IR_Control_U_IR#3.2 U10_U_IR_Control_U_IR#3.2 U11_U_IR_Control_U_IR#3.2 U12_U_IR_Control_U_IR#3.2), U_IR_Control/U_IR (U9_U_IR_Control_U_IR#4.2 U10_U_IR_Control_U_IR#4.2 U11_U_IR_Control_U_IR#4.2 U12_U_IR_Control_U_IR#4.2), MotorControl (10 pins), SonarControl (C41.2 C42.2 Q21.2), SD_Card (6 pins), DS12885 (11 pins), PowerUnit (16 pins)
VCC: OV7725 (9 pins), OV7725_CRYSTAL (Y3.4), AL422B (C28.1 C29.1 U5.10 U5.19), SN74LVC1G00 (C27.2 U4.5)
ADDA1: MainBoard (U1.15), PowerUnit (J1.2 P1.1)
IR_CLK: MainBoard (P8.1 U1.58), IR_Control (U13.8)
IR_MISO: MainBoard (P8.3 U1.60), IR_Control (U13.6)
IR_MOSI: MainBoard (P8.2 U1.59), IR_Control (U13.7)
IR_RESET: MainBoard (P8.4 U1.61), IR_Control (Q19.3)
MC_MISO: MainBoard (P9.3 U1.1), MotorControl (P6.5 U16.13)
MC_MOSI: MainBoard (P9.4 U1.2), MotorControl (P6.4 U16.12)
MC_RST_IN: MainBoard (P9.1 U1.97), MotorControl (C40.2 U16.17)
MC_RST_OUT: MainBoard (P9.2 U1.98), MotorControl (P6.6 U16.32)
MC_SCLK: MainBoard (P9.5 U1.3), MotorControl (P6.3 U16.14)
MISO_2: MainBoard (P20.3 U1.39), SonarControl (P19.5 U17.13)
MOSI_2: MainBoard (P20.4 U1.40), SonarControl (P19.4 U17.12)
Net*_1: ESP8266 (U7.20), 25Q80_SO (*.1)
Net*_2: ESP8266 (U7.22), 25Q80_SO (*.2)
Net*_3: ESP8266 (U7.19), 25Q80_SO (*.3)
Net*_5: ESP8266 (U7.23), 25Q80_SO (*.5)
Net*_6: ESP8266 (R20.2), 25Q80_SO (*.6)
Net*_7: ESP8266 (U7.18), 25Q80_SO (*.7)
NetC1_2: MainBoard (U2.12), OSC&RESET (C1.2 Y1.2 Y2.2)
NetC2_2: MainBoard (J4.15 U2.14), OSC&RESET (C2.2 K1.1 K1.2 R1.1)
NetC3_2: MainBoard (U2.13), OSC&RESET (C3.2 Y1.1 Y2.1)
NetC22_1: OV7725 (C22.1 R10.1 U3.B6), SN74LVC1G00 (U4.2)
NetC30_2: MainBoard (U1.35), AL422B (C30.2 R13.2 U5.21)
NetC31_2: MainBoard (U1.36), AL422B (C31.2 R14.2 U5.8)
NetC33_1: MainBoard (C33.1), W25Q256 (U8.1 U8.3 U8.9)
NetC47_2: MainBoard (U1.65), DS12885 (C47.2)
NetD3_K: MainBoard (U1.57), ESP8266 (D3.K U7.26)
NetJ3_2: MainBoard (U1.71), PowerUnit (J3.2)
NetJ3_3: MainBoard (U1.70), PowerUnit (J3.3 R2.1)
NetQ1_1: MainBoard (U1.87), PowerUnit (Q1.1)
NetQ3_3: IR_Control (Q3.3), U_IR_Control/U_IR (R22_U_IR_Control_U_IR#1.1 U9_U_IR_Control_U_IR#1.1)
NetQ4_3: IR_Control (Q4.3), U_IR_Control/U_IR (R23_U_IR_Control_U_IR#1.1 U10_U_IR_Control_U_IR#1.1)
NetQ5_3: IR_Control (Q5.3), U_IR_Control/U_IR (R24_U_IR_Control_U_IR#1.1 U11_U_IR_Control_U_IR#1.1)
NetQ6_3: IR_Control (Q6.3), U_IR_Control/U_IR (R25_U_IR_Control_U_IR#1.1 U12_U_IR_Control_U_IR#1.1)
NetQ7_3: IR_Control (Q7.3), U_IR_Control/U_IR (R22_U_IR_Control_U_IR#2.1 U9_U_IR_Control_U_IR#2.1)
NetQ8_3: IR_Control (Q8.3), U_IR_Control/U_IR (R23_U_IR_Control_U_IR#2.1 U10_U_IR_Control_U_IR#2.1)
NetQ9_3: IR_Control (Q9.3), U_IR_Control/U_IR (R24_U_IR_Control_U_IR#2.1 U11_U_IR_Control_U_IR#2.1)
NetQ10_3: IR_Control (Q10.3), U_IR_Control/U_IR (R25_U_IR_Control_U_IR#2.1 U12_U_IR_Control_U_IR#2.1)
NetQ11_3: IR_Control (Q11.3), U_IR_Control/U_IR (R22_U_IR_Control_U_IR#3.1 U9_U_IR_Control_U_IR#3.1)
NetQ12_3: IR_Control (Q12.3), U_IR_Control/U_IR (R23_U_IR_Control_U_IR#3.1 U10_U_IR_Control_U_IR#3.1)
NetQ13_3: IR_Control (Q13.3), U_IR_Control/U_IR (R24_U_IR_Control_U_IR#3.1 U11_U_IR_Control_U_IR#3.1)
NetQ14_3: IR_Control (Q14.3), U_IR_Control/U_IR (R25_U_IR_Control_U_IR#3.1 U12_U_IR_Control_U_IR#3.1)
NetQ15_3: IR_Control (Q15.3), U_IR_Control/U_IR (R22_U_IR_Control_U_IR#4.1 U9_U_IR_Control_U_IR#4.1)
NetQ16_3: IR_Control (Q16.3), U_IR_Control/U_IR (R23_U_IR_Control_U_IR#4.1 U10_U_IR_Control_U_IR#4.1)
NetQ17_3: IR_Control (Q17.3), U_IR_Control/U_IR (R24_U_IR_Control_U_IR#4.1 U11_U_IR_Control_U_IR#4.1)
NetQ18_3: IR_Control (Q18.3), U_IR_Control/U_IR (R25_U_IR_Control_U_IR#4.1 U12_U_IR_Control_U_IR#4.1)
NetR16_1: MainBoard (U1.46), DS18B20 (R16.1 U6.2)
NetR21_1: MainBoard (U1.55), ESP8266 (R21.1)
NetR26_1: MainBoard (U1.80), SD_Card (R26.1 TF1.3)
NetR27_1: MainBoard (U1.7), SD_Card (R27.1 TF1.5)
NetR28_1: MainBoard (U1.45), SD_Card (R28.1 TF1.2)
NetR29_1: MainBoard (U1.44), SD_Card (R29.1 TF1.1)
NetR30_1: MainBoard (U1.43), SD_Card (R30.1 TF1.8)
NetR31_1: MainBoard (U1.42), SD_Card (R31.1 TF1.7)
NetU1_34: MainBoard (U1.34), DS12885 (U20.17)
NetU1_56: MainBoard (U1.56), ESP8266 (U7.25)
NetU1_63: MainBoard (U1.63), DS12885 (U20.15)
NetU1_64: MainBoard (U1.64), DS12885 (U20.14)
NetU1_66: MainBoard (U1.66), DS12885 (U19.3)
NetU1_78: MainBoard (U1.78), DS12885 (U19.2)
NetU1_79: MainBoard (U1.79), DS12885 (U19.1)
NetU1_81: MainBoard (U1.81), W25Q256 (U8.8)
NetU1_82: MainBoard (U1.82), W25Q256 (U8.15)
NetU1_83: MainBoard (U1.83), W25Q256 (U8.16)
NetU1_88: MainBoard (U1.88), ESP8266 (U7.32)
NetU3_D1: OV7725 (U3.D1), AL422B (U5.4)
NetU3_D6: OV7725 (U3.D6), AL422B (U5.3)
NetU3_E1: OV7725 (U3.E1), AL422B (U5.12)
NetU3_E4: OV7725 (U3.E4), AL422B (U5.9)
NetU3_E6: OV7725 (U3.E6), AL422B (U5.11)
NetU3_F1: OV7725 (U3.F1), AL422B (U5.14)
NetU3_F2: OV7725 (U3.F2), AL422B (U5.2)
NetU3_F3: OV7725 (U3.F3), OV7725_CRYSTAL (Y3.3)
NetU3_F5: OV7725 (U3.F5), AL422B (U5.1)
NetU3_F6: OV7725 (U3.F6), AL422B (U5.13)
NetU4_4: AL422B (U5.5), SN74LVC1G00 (U4.4)
OV_DO0: MainBoard (P11.3 U1.25), AL422B (U5.28)
OV_DO1: MainBoard (P11.4 U1.26), AL422B (U5.27)
OV_DO2: MainBoard (P11.5 U1.29), AL422B (U5.26)
OV_DO3: MainBoard (P11.6 U1.30), AL422B (U5.25)
OV_DO4: MainBoard (P11.7 U1.31), AL422B (U5.18)
OV_DO5: MainBoard (P11.8 U1.32), AL422B (U5.17)
OV_DO6: MainBoard (P11.9 U1.67), AL422B (U5.16)
OV_DO7: MainBoard (P11.10 U1.68), AL422B (U5.15)
OV_SIO_C: MainBoard (P11.1 U1.23), OV7725 (R8.1 U3.A5)
OV_SIO_D: MainBoard (P11.2 U1.24), OV7725 (R9.1 U3.B5)
RST_IN_2: MainBoard (P20.1 U1.5), SonarControl (C43.2 U17.17)
RST_OUT_2: MainBoard (P20.2 U1.38), SonarControl (P19.6 U17.32)
SC_SCLK: MainBoard (P20.5 U1.41), SonarControl (P19.3 U17.14)